# Altium project develboard-sdk.PrjPcb (part 1 of 2)
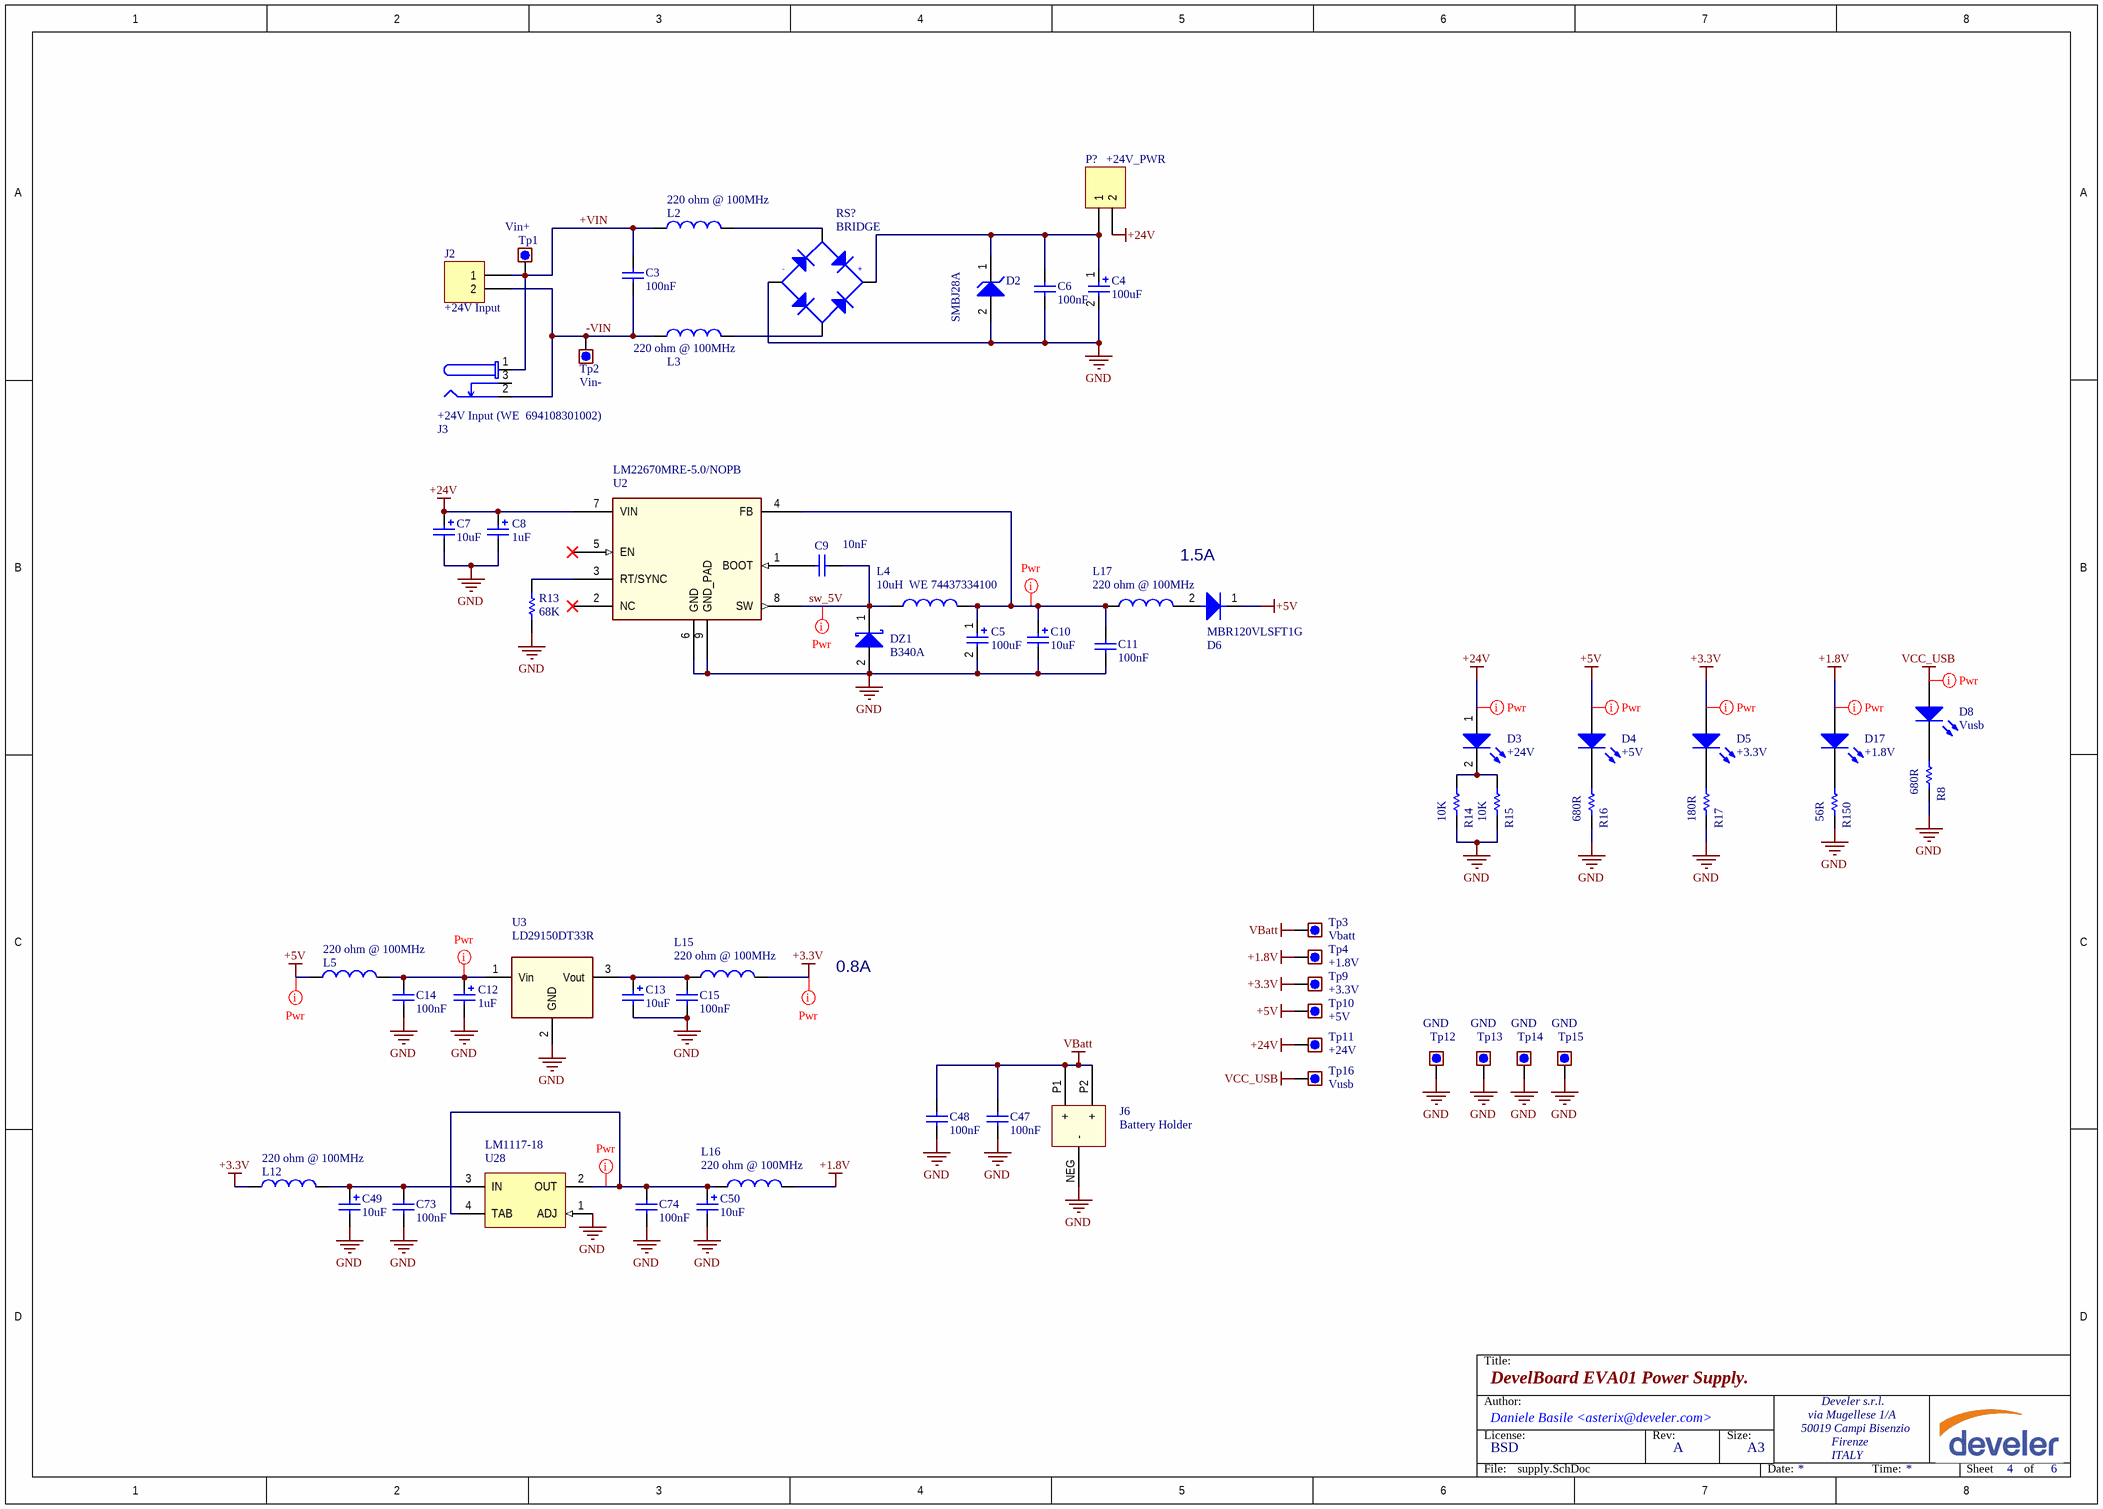
[diagram p0: supply.SchDoc]
6 sheets, 204 parts. Net scope: flat (ports and power ports of the same name join across sheets).
Board file: develboard_sdk.PcbDoc
Sheets:
  supply.SchDoc
  wifi.schdoc
  develboard.SchDoc
  usb_ethernet.SchDoc
  sd_debug.SchDoc
  connectors.SchDoc

## Sheet supply.SchDoc: DevelBoard EVA01 Power Supply.
size A3; Author: Daniele Basile <asterix@develer.com>; Organization: Develer s.r.l.; Address1: via Mugellese 1/A; Address2: 50019 Campi Bisenzio; Address3: Firenze; Address4: ITALY; DocumentNumber: 2; Revision: A; SheetNumber: 4; SheetTotal: 6

### Parts
(Parts that share a designator on the sheet are numbered #1, #2 ... from top to bottom, then left to right.)
C3  100nF  [0603_[1608]]
C4  100uF  [CAP_6x6_D8_SMD]
C5  100uF  [[7343]_CAP_TAN]
C6  100nF  [0603_[1608]]
C7  10uF  [1206_[3216]]
C8  1uF  [1206_[3216]]
C9  10nF  [0603_[1608]]
C10  10uF  [1206_[3216]]
C11  100nF  [0603_[1608]]
C12  1uF  [1206_[3216]]
C13  10uF  [1206_[3216]]
C14  100nF  [0603_[1608]]
C15  100nF  [0603_[1608]]
C47  100nF  [0603_[1608]]
C48  100nF  [0603_[1608]]
C49  10uF  [1206_[3216]]
C50  10uF  [1206_[3216]]
C73  100nF  [0603_[1608]]
C74  100nF  [0603_[1608]]
D2  SMBJ28A  [DO214AA_12]
D3  +24V  [0603_[1608]_LED]
D4  +5V  [0603_[1608]_LED]
D5  +3.3V  [0603_[1608]_LED]
D6  MBR120VLSFT1G  [SOD-123]
D8  Vusb  [0603_[1608]_LED]
D17  +1.8V  [0603_[1608]_LED]
DZ1  B340A  [DO214AA_12]
J2  +24V Input  [TBLOCK_1X2_3.5MM_HOR_THD]
J3  +24V Input (WE  694108301002)  [DC_Jack_6.5x2.5mm_right_tht]
J6  Battery Holder  [Battery_holder_20mm_thd]
L2  220 ohm @ 100MHz  [0805_[2012]]
L3  220 ohm @ 100MHz  [0805_[2012]]
L4  10uH  WE 74437334100  [WE-LHMI_5020]
L5  220 ohm @ 100MHz  [0805_[2012]]
L12  220 ohm @ 100MHz  [0805_[2012]]
L15  220 ohm @ 100MHz  [0805_[2012]]
L16  220 ohm @ 100MHz  [0805_[2012]]
L17  220 ohm @ 100MHz  [0805_[2012]]
P?#1  +24V_PWR  [HDR1X2]
R8  680R  [0603_[1608]]
R13  68K  [0603_[1608]]
R14  10K  [0603_[1608]]
R15  10K  [0603_[1608]]
R16  680R  [0603_[1608]]
R17  180R  [0603_[1608]]
R150  56R  [0603_[1608]]
RS?  BRIDGE
Tp1  Vin+  [TEST_POINT_THD_D1.6MM]  (no BOM)
Tp2  Vin-  [TEST_POINT_THD_D1.6MM]  (no BOM)
Tp3  Vbatt  [TEST_POINT_THD_D1.6MM]  (no BOM)
Tp4  +1.8V  [TEST_POINT_THD_D1.6MM]  (no BOM)
Tp9  +3.3V  [TEST_POINT_THD_D1.6MM]  (no BOM)
Tp10  +5V  [TEST_POINT_THD_D1.6MM]  (no BOM)
Tp11  +24V  [TEST_POINT_THD_D1.6MM]  (no BOM)
Tp12  GND  [TEST_POINT_THD_D1.6MM]  (no BOM)
Tp13  GND  [TEST_POINT_THD_D1.6MM]  (no BOM)
Tp14  GND  [TEST_POINT_THD_D1.6MM]  (no BOM)
Tp15  GND  [TEST_POINT_THD_D1.6MM]  (no BOM)
Tp16  Vusb  [TEST_POINT_THD_D1.6MM]  (no BOM)
U2  LM22670MRE-5.0/NOPB  [SOIC8_PAD]
U3  LD29150DT33R  [TO-252_D2PAK_LARGEPAD]
U28  LM1117-18  [SOT-223]

### Nets
+1.8V: D17.1(A) L16.1 Tp4.1
+3.3V: D5.1(A) L12.1 L15.1 Tp9.1
+5V: D4.1(A) D6.1(K) L5.1 Tp10.1
+24V: C7.1 C8.1 D3.1(A) P?#1.2 Tp11.1 U2.7(VIN)
GND: C4.2 C5.2 C6.1 C7.2 C8.2 C10.2 C11.1 C12.2 C13.2 C14.1 C15.1 C47.1 C48.1 C49.2 C50.2 C73.1 C74.1 D2.2(A) DZ1.2(A) J6.NEG(-) R8.1 R13.1 R14.1 R15.1 R16.1 R17.1 R150.1 RS?.2 Tp12.1 Tp13.1 Tp14.1 Tp15.1 U2.6(GND) U2.9(GND_PAD) U3.2(GND) U28.1(ADJ)
VBatt: C47.2 C48.2 J6.P1(+) J6.P2(+) Tp3.1
VCC_USB: D8.1(A) Tp16.1
+VIN: C3.2 J2.1 J3.1 L2.1 Tp1.1
-VIN: C3.1 J2.2 J3.2 L3.1 Tp2.1
sw_5V: C9.2 DZ1.1(K) L4.1 U2.8(SW)
NetC4_1: C4.1 C6.2 D2.1(K) P?#1.1 RS?.4
NetC5_1: C5.1 C10.1 C11.2 L4.2 L17.2 U2.4(FB)
NetC9_1: C9.1 U2.1(BOOT)
NetC12_1: C12.1 C14.2 L5.2 U3.1(Vin)
NetC13_1: C13.1 C15.2 L15.2 U3.3(Vout)
NetC49_1: C49.1 C73.2 L12.2 U28.3(IN)
NetC50_1: C50.1 C74.2 L16.2 U28.2(OUT) U28.4(TAB)
NetD3_2: D3.2(K) R14.2 R15.2
NetD4_2: D4.2(K) R16.2
NetD5_2: D5.2(K) R17.2
NetD6_2: D6.2(A) L17.1
NetD8_2: D8.2(K) R8.2
NetD17_2: D17.2(K) R150.2
NetL2_2: L2.2 RS?.1
NetL3_2: L3.2 RS?.3
NetR13_2: R13.2 U2.3(RT/SYNC)

Not connected (* = marked no-connect by the designer): J3 3; U2 2(NC)* 5(EN)*

### Layout directives
net class Power: +1.8V, +3.3V, +5V, +24V, NetC5_1, NetC12_1, NetC50_1, sw_5V, VCC_USB

### Notes on the sheet
- 1.5A
- 0.8A
- Title:
- Author:
- License:
- BSD
- Rev:
- Size:
- A3
- File:
- Date:
- Time:
- Sheet
- of
- (in symbol PONTE) -; +

### Library data of the parts
C3 C6 C9 C11 C14 C15 C47 C48 C73 C74 = Cap: Ceramic X7R 50V; Value: 100pF; Published: 8-Jun-2000; LatestRevisionDate: 17-Jul-2002; LatestRevisionNote: Re-released for DXP Platform.; PackageReference: RAD-0.3; Publisher: Altium Limited; PackageDescription: Radial Cap, Thru-Hole; 2 Leads; 0.3 in Pin Spacing
C4 = Cap Pol1: EEEFK1H101P SMT 6x6 35V; Value: 10uF; Published: 8-Jun-2000; Revision: July-2002: Re-released for DXP Platform.; Publisher: Altium Limited
C5 = Cap Pol1: Tantalum 10V (T495D107K010ATE100); Value: 10uF; Published: 8-Jun-2000; Revision: July-2002: Re-released for DXP Platform.; Publisher: Altium Limited
C7 C10 C13 C49 C50 = Cap Pol1: Ceramic X7R 50V; Published: 8-Jun-2000; Revision: July-2002: Re-released for DXP Platform.; Publisher: Altium Limited; Value: 10uF
C8 C12 = Cap Pol1: Ceramic X7R 50V; Value: 10uF; Published: 8-Jun-2000; Revision: July-2002: Re-released for DXP Platform.; Publisher: Altium Limited
D2 = D Zener: TRANSIL (SM6T12A); Published: 8-Jun-2000; LatestRevisionDate: 17-Jul-2002; LatestRevisionNote: Re-released for DXP Platform.; PackageReference: DIODE-0.7; Publisher: Altium Limited; PackageDescription: Diode, Thru-Hole; 2 Leads; 0.7 in Pin Spacing
D3-D5 D8 D17 = LED0: LED Green; Published: 8-Jun-2000; LatestRevisionDate: 08-Jul-2005; LatestRevisionNote: Mech Layer 1 removed.; PackageReference: LED-0; Publisher: Altium Limited; PackageDescription: LED; 2 Leads
D6 = Diode: Diode Schottky  low Vf, If 1A (PMEG3010ER; MBRX120LF)
DZ1 = D Schottky: Diode Schottky (STPS2L40U); Published: 8-Jun-2000; LatestRevisionDate: 17-Jul-2002; LatestRevisionNote: Re-released for DXP Platform.; PackageReference: SMB; Publisher: Altium Limited; PackageDescription: DO-214-AA/SMB; 2 C-Bend Leads; Body 5.3 x 3.6 mm, inc. leads (LxW); Code_JEDEC: DO-214-AA
J2 = Header 2: Terminal block Header 3.5mm Horizontal (WE 691322110002); LatestRevisionDate: 17-Jul-2002; LatestRevisionNote: Re-released for DXP Platform.; Publisher: Altium Limited
J3 = WE-DC Power Jack 694108301002: WR-DC_DC Power Jack_Right Angled_THT; Manufacturer: W¨¹rth Elektronik eiSos GmbH; ComponentLink1 Description: Manufacturer; ComponentLink2 Description: Datasheet; NoPins: 3; ComponentLink1URL: http://www.we-online.de; ComponentLink2URL: http://katalog.we-online.de/em/datasheet/6941xx301002.pdf; Created by: Karrer Zheng; Created Date: 10/17/2014; partNo: 694108301002
J6 = Battery_holder_3002: WE 79523211; KEYSTONE 3009
L2 L3 L5 L12 = Inductor: WE 742792022; Code_IEC: 1005; Value: 10mH; Published: 8-Jun-2000; LatestRevisionDate: 29-May-2009; LatestRevisionNote: IPC-7351 Footprint Added.; PackageReference: 0402-A; Publisher: Altium Limited; PackageDescription: Chip Inductor; Code_JEITA: 0402
L4 = Inductor: SMD Shielded Tiny Power Inductor; Code_IEC: 1005; Value: 10mH; Published: 8-Jun-2000; LatestRevisionDate: 29-May-2009; LatestRevisionNote: IPC-7351 Footprint Added.; PackageReference: 0402-A; Publisher: Altium Limited; PackageDescription: Chip Inductor; Code_JEITA: 0402
L15-L17 = Inductor: WE 742792022
P?#1 = Header 2: Header, 2-Pin; LatestRevisionDate: 17-Jul-2002; LatestRevisionNote: Re-released for DXP Platform.; Publisher: Altium Limited
R8 R13-R17 R150 = Res1: Resistor; Revision: July-2002: Re-released for DXP Platform.
RS? = PONTE
Tp1-Tp4 Tp9-Tp16 = Test_point
U2 = LM22670MR-ADJ
U3 = LD29150DT33R: Very Low Drop Linear regulator 3.3V (BA33BC0FP-E2; MIC2940A-3.3WU)
U28 = LM317AEMP: LDO, ADJ (ZLDO1117;LM1117IMP-ADJ/NOPB;LD1117S); Manufacturer: National Semiconductor; PackageTopMarking: XYTT*N07A; PowerWise: N; CompType: LDO IC; Published: 4-Dec-2008; DatasheetVersion: Apr-2007; PackageVersion: revB, Apr-2003; PackageReference: MP04A; Publisher: Altium Limited; PackageDescription: Molded SOT-223, 6.50 x 3.56 x 1.6mm Body, 4 Lead, 2.3mm Pitch; Supplier 1: Farnell; Supplier Part Number 1: 9779272RL; Supplier 2: Farnell; Supplier Part Number 2: 9779272; PartNumber: LM317AEMP; RoHS: N; PinCount: 4; Code_JEDEC: TO-261-AA; Code_IPC: SOT223-4; ComponentLink1Description: LM317 Datasheet; ComponentLink1URL: http://www.national.com/ds/LM/LM317.pdf; ComponentLink2Description: LM317 Web Page; ComponentLink2URL: http://www.national.com/pf/LM/LM317.html; ComponentLink3Description: MP04A Package Page; ComponentLink3URL: http://www.national.com/packaging/folders/mp04a.html

## Sheet wifi.schdoc: DevelBoard EVA WiFi Module.
size A3; Author: Daniele Basile <asterix@develer.com>; Organization: Develer s.r.l.; Address1: via Mugellese 1/A; Address2: 50019 Campi Bisenzio; Address3: Firenze; Address4: ITALY; DocumentNumber: 6; Revision: EVA 0; SheetNumber: 6; SheetTotal: 6
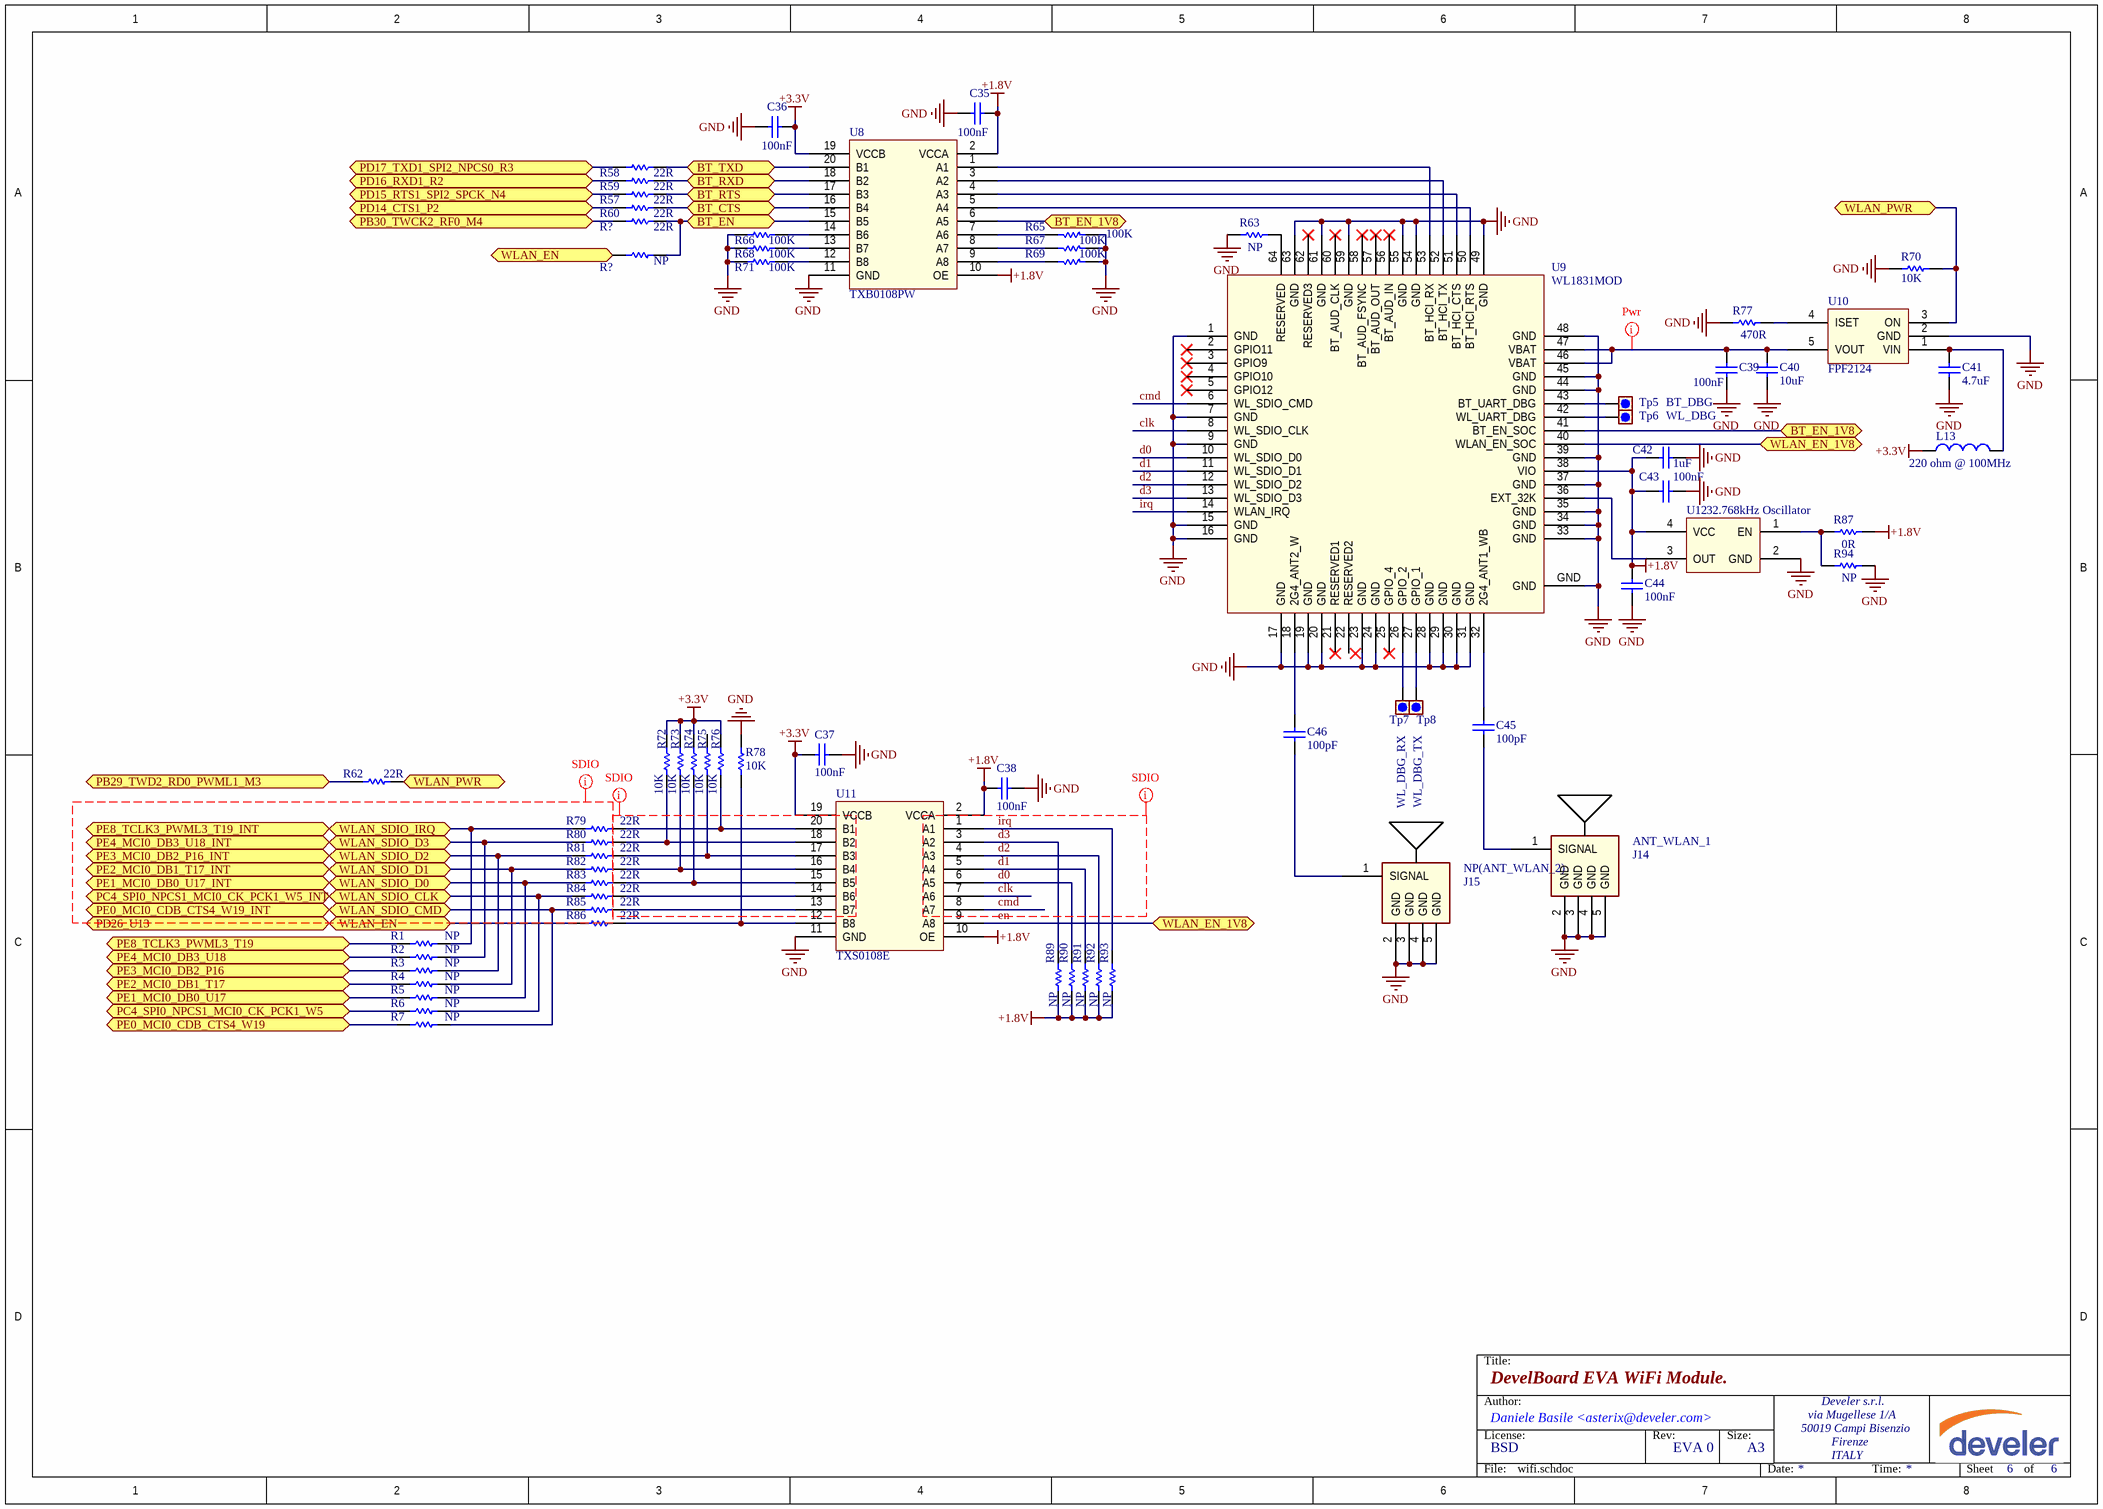
[diagram p1: wifi.schdoc]

### Parts
(Parts that share a designator on the sheet are numbered #1, #2 ... from top to bottom, then left to right.)
C35  100nF  [0603_[1608]]
C36  100nF  [0603_[1608]]
C37  100nF  [0603_[1608]]
C38  100nF  [0603_[1608]]
C39  100nF  [0603_[1608]]
C40  10uF  [1206_[3216]]
C41  4.7uF  [0805_[2012]]
C42  1uF  [1206_[3216]]
C43  100nF  [0603_[1608]]
C44  100nF  [0603_[1608]]
C45  100pF  [0603_[1608]]
C46  100pF  [0603_[1608]]
J14  ANT_WLAN_1  [SMA_Jack_Female_5.08mm_THD]
J15  NP(ANT_WLAN_2)  [SMA_Jack_Female_5.08mm_THD]
L13  220 ohm @ 100MHz  [0805_[2012]]
R1  NP  [0603_[1608]]
R2  NP  [0603_[1608]]
R3  NP  [0603_[1608]]
R4  NP  [0603_[1608]]
R5  NP  [0603_[1608]]
R6  NP  [0603_[1608]]
R7  NP  [0603_[1608]]
R57  22R  [0603_[1608]]
R58  22R  [0603_[1608]]
R59  22R  [0603_[1608]]
R60  22R  [0603_[1608]]
R62  22R  [0603_[1608]]
R63  NP  [0603_[1608]]
R65  100K  [0603_[1608]]
R66  100K  [0603_[1608]]
R67  100K  [0603_[1608]]
R68  100K  [0603_[1608]]
R69  100K  [0603_[1608]]
R70  10K  [0603_[1608]]
R71  100K  [0603_[1608]]
R72  10K  [0603_[1608]]
R73  10K  [0603_[1608]]
R74  10K  [0603_[1608]]
R75  10K  [0603_[1608]]
R76  10K  [0603_[1608]]
R77  470R  [0603_[1608]]
R78  10K  [0603_[1608]]
R79  22R  [0603_[1608]]
R80  22R  [0603_[1608]]
R81  22R  [0603_[1608]]
R82  22R  [0603_[1608]]
R83  22R  [0603_[1608]]
R84  22R  [0603_[1608]]
R85  22R  [0603_[1608]]
R86  22R  [0603_[1608]]
R87  0R  [0603_[1608]]
R89  NP  [0603_[1608]]
R90  NP  [0603_[1608]]
R91  NP  [0603_[1608]]
R92  NP  [0603_[1608]]
R93  NP  [0603_[1608]]
R94  NP  [0603_[1608]]
R?#1  22R  [0603_[1608]]
R?#2  NP  [0603_[1608]]
Tp5  BT_DBG  [TEST_POINT_SMD_D1MM]  (no BOM)
Tp6  WL_DBG  [TEST_POINT_SMD_D1MM]  (no BOM)
Tp7  WL_DBG_RX  [TEST_POINT_SMD_D1MM]  (no BOM)
Tp8  WL_DBG_TX  [TEST_POINT_SMD_D1MM]  (no BOM)
U8  TXB0108PW  [TSOP65P640X120-20L]
U9  WL1831MOD  [WL18XX_E-13.4X13.3-N100_0.75]
U10  FPF2124  [SOT-23-5]
U11  TXS0108E  [TSOP65P640X120-20L]
U12  32.768kHz Oscillator  [CRYSTAL_3.2X1.5MM_4P_SMD]

### Ports
BT_CTS, BT_EN, BT_EN_1V8, BT_RTS, BT_RXD, BT_TXD, PB29_TWD2_RD0_PWML1_M3, PB30_TWCK2_RF0_M4, PC4_SPI0_NPCS1_MCI0_CK_PCK1_W5, PC4_SPI0_NPCS1_MCI0_CK_PCK1_W5_INT, PD14_CTS1_P2, PD15_RTS1_SPI2_SPCK_N4, PD16_RXD1_R2, PD17_TXD1_SPI2_NPCS0_R3, PD26_U13, PE0_MCI0_CDB_CTS4_W19, PE0_MCI0_CDB_CTS4_W19_INT, PE1_MCI0_DB0_U17, PE1_MCI0_DB0_U17_INT, PE2_MCI0_DB1_T17, PE2_MCI0_DB1_T17_INT, PE3_MCI0_DB2_P16, PE3_MCI0_DB2_P16_INT, PE4_MCI0_DB3_U18, PE4_MCI0_DB3_U18_INT, PE8_TCLK3_PWML3_T19, PE8_TCLK3_PWML3_T19_INT, WLAN_EN, WLAN_EN_1V8, WLAN_PWR, WLAN_SDIO_CLK, WLAN_SDIO_CMD, WLAN_SDIO_D0, WLAN_SDIO_D1, WLAN_SDIO_D2, WLAN_SDIO_D3, WLAN_SDIO_IRQ

### Nets
+1.8V: C35.2 C38.2 C42.2 C43.2 C44.2 R87.1 R89.1 R90.1 R91.1 R92.1 R93.1 U8.2(VCCA) U8.10(OE) U9.38(VIO) U11.2(VCCA) U11.10(OE) U12.4(VCC)
+3.3V: C36.2 C37.2 L13.2 R72.1 R73.1 R74.1 R76.1 U8.19(VCCB) U11.19(VCCB)
GND: C35.1 C36.1 C37.1 C38.1 C39.1 C40.1 C41.1 C42.1 C43.1 C44.1 J14.2(GND) J14.3(GND) J14.4(GND) J14.5(GND) J15.2(GND) J15.3(GND) J15.4(GND) J15.5(GND) R63.2 R65.2 R66.2 R67.2 R68.2 R69.2 R70.1 R71.2 R77.2 R78.1 R94.1 U8.11(GND) U9.1(GND) U9.7(GND) U9.9(GND) U9.15(GND) U9.16(GND) U9.17(GND) U9.19(GND) U9.20(GND) U9.23(GND) U9.24(GND) U9.28(GND) U9.29(GND) U9.30(GND) U9.31(GND) U9.33(GND) U9.34(GND) U9.35(GND) U9.37(GND) U9.39(GND) U9.44(GND) U9.45(GND) U9.48(GND) U9.49(GND) U9.54(GND) U9.55(GND) U9.59(GND) U9.61(GND) U9.63(GND) U9.GND U10.2(GND) U11.11(GND) U12.2(GND)
BT_CTS: R60.2 U8.16(B4) ; port BT_CTS
BT_EN: R?#1.2 R?#2.2 U8.15(B5) ; port BT_EN
BT_EN_1V8: U8.6(A5) U9.41(BT_EN_SOC) ; port BT_EN_1V8
BT_RTS: R57.2 U8.17(B3) ; port BT_RTS
BT_RXD: R59.2 U8.18(B2) ; port BT_RXD
BT_TXD: R58.2 U8.20(B1) ; port BT_TXD
clk: U9.8(WL_SDIO_CLK) U11.7(A6)
cmd: U9.6(WL_SDIO_CMD) U11.8(A7)
d0: R90.2 U9.10(WL_SDIO_D0) U11.6(A5)
d1: R91.2 U9.11(WL_SDIO_D1) U11.5(A4)
d2: R92.2 U9.12(WL_SDIO_D2) U11.4(A3)
d3: R89.2 U9.13(WL_SDIO_D3) U11.3(A2)
en: U9.40(WLAN_EN_SOC) U11.9(A8) ; port WLAN_EN_1V8
irq: R93.2 U9.14(WLAN_IRQ) U11.1(A1)
PB29_TWD2_RD0_PWML1_M3: R62.1 ; port PB29_TWD2_RD0_PWML1_M3
PB30_TWCK2_RF0_M4: R?#1.1 ; port PB30_TWCK2_RF0_M4
PC4_SPI0_NPCS1_MCI0_CK_PCK1_W5: R6.2 ; port PC4_SPI0_NPCS1_MCI0_CK_PCK1_W5
PC4_SPI0_NPCS1_MCI0_CK_PCK1_W5_INT: R6.1 R84.2 ; port WLAN_SDIO_CLK, port PC4_SPI0_NPCS1_MCI0_CK_PCK1_W5_INT
PD14_CTS1_P2: R60.1 ; port PD14_CTS1_P2
PD15_RTS1_SPI2_SPCK_N4: R57.1 ; port PD15_RTS1_SPI2_SPCK_N4
PD16_RXD1_R2: R59.1 ; port PD16_RXD1_R2
PD17_TXD1_SPI2_NPCS0_R3: R58.1 ; port PD17_TXD1_SPI2_NPCS0_R3
PD26_U13: R86.2 R?#2.1 ; port WLAN_EN, port PD26_U13
PE0_MCI0_CDB_CTS4_W19: R7.2 ; port PE0_MCI0_CDB_CTS4_W19
PE0_MCI0_CDB_CTS4_W19_INT: R7.1 R85.2 ; port WLAN_SDIO_CMD, port PE0_MCI0_CDB_CTS4_W19_INT
PE1_MCI0_DB0_U17: R5.2 ; port PE1_MCI0_DB0_U17
PE1_MCI0_DB0_U17_INT: R5.1 R83.2 ; port WLAN_SDIO_D0, port PE1_MCI0_DB0_U17_INT
PE2_MCI0_DB1_T17: R4.2 ; port PE2_MCI0_DB1_T17
PE2_MCI0_DB1_T17_INT: R4.1 R82.2 ; port WLAN_SDIO_D1, port PE2_MCI0_DB1_T17_INT
PE3_MCI0_DB2_P16: R3.2 ; port PE3_MCI0_DB2_P16
PE3_MCI0_DB2_P16_INT: R3.1 R81.2 ; port WLAN_SDIO_D2, port PE3_MCI0_DB2_P16_INT
PE4_MCI0_DB3_U18: R2.2 ; port PE4_MCI0_DB3_U18
PE4_MCI0_DB3_U18_INT: R2.1 R80.2 ; port WLAN_SDIO_D3, port PE4_MCI0_DB3_U18_INT
PE8_TCLK3_PWML3_T19: R1.2 ; port PE8_TCLK3_PWML3_T19
PE8_TCLK3_PWML3_T19_INT: R1.1 R79.2 ; port WLAN_SDIO_IRQ, port PE8_TCLK3_PWML3_T19_INT
WLAN_PWR: R62.2 R70.2 U10.3(ON) ; port WLAN_PWR
NetC39_2: C39.2 C40.2 U9.46(VBAT) U9.47(VBAT) U10.5(VOUT)
NetC41_2: C41.2 L13.1 U10.1(VIN)
NetC45_1: C45.1 U9.32(2G4_ANT1_WB)
NetC45_2: C45.2 J14.1(SIGNAL)
NetC46_1: C46.1 U9.18(2G4_ANT2_W)
NetC46_2: C46.2 J15.1(SIGNAL)
NetR63_1: R63.1 U9.64(RESERVED)
NetR65_1: R65.1 U8.7(A6)
NetR66_1: R66.1 U8.14(B6)
NetR67_1: R67.1 U8.8(A7)
NetR68_1: R68.1 U8.13(B7)
NetR69_1: R69.1 U8.9(A8)
NetR71_1: R71.1 U8.12(B8)
NetR72_2: R72.2 R80.1 U11.18(B2)
NetR73_2: R73.2 R82.1 U11.16(B4)
NetR74_2: R74.2 R83.1 U11.15(B5)
NetR75_2: R75.2 R81.1 U11.17(B3)
NetR76_2: R76.2 R79.1 U11.20(B1)
NetR77_1: R77.1 U10.4(ISET)
NetR78_2: R78.2 R86.1 U11.12(B8)
NetR84_1: R84.1 U11.14(B6)
NetR85_1: R85.1 U11.13(B7)
NetR87_2: R87.2 R94.2 U12.1(EN)
NetTp5_1: Tp5.1 U9.43(BT_UART_DBG)
NetTp6_1: Tp6.1 U9.42(WL_UART_DBG)
NetTp7_1: Tp7.1 U9.26(GPIO_2)
NetTp8_1: Tp8.1 U9.27(GPIO_1)
NetU8_1: U8.1(A1) U9.53(BT_HCI_RX)
NetU8_3: U8.3(A2) U9.52(BT_HCI_TX)
NetU8_4: U8.4(A3) U9.51(BT_HCI_CTS)
NetU8_5: U8.5(A4) U9.50(BT_HCI_RTS)
NetU9_36: U9.36(EXT_32K) U12.3(OUT)

Not connected (* = marked no-connect by the designer): R75 1; U9 2(GPIO11)* 3(GPIO9)* 4(GPIO10)* 5(GPIO12)* 21(RESERVED1)* 22(RESERVED2) 25(GPIO_4)* 56(BT_AUD_IN)* 57(BT_AUD_OUT)* 58(BT_AUD_FSYNC)* 60(BT_AUD_CLK)* 62(RESERVED3)*

### Layout directives
net class Power: NetC39_2
net class SDIO_BUS: (no net found under the mark)
net class SDIO: (no net found under the mark)
net class SDIO_LOWBUS: clk, cmd, d0, d1, d2, d3, irq

### Notes on the sheet
- Title:
- Author:
- License:
- BSD
- Rev:
- Size:
- A3
- File:
- Date:
- Time:
- Sheet
- of

### Library data of the parts
C35-C39 C42-C44 = Cap: Ceramic X7R 50V; Value: 10nF; Published: 8-Jun-2000; Revision: July-2002: Re-released for DXP Platform.; Publisher: Altium Limited
C40 = Cap: Ceramic X5R 25V; Value: 10nF; Published: 8-Jun-2000; Revision: July-2002: Re-released for DXP Platform.; Publisher: Altium Limited
C41 = Cap: Ceramic X7R 10V; Value: 10nF; Published: 8-Jun-2000; Revision: July-2002: Re-released for DXP Platform.; Publisher: Altium Limited
C45 C46 = Cap: Ceramic COG 50V; Value: 10nF; Published: 8-Jun-2000; Revision: July-2002: Re-released for DXP Platform.; Publisher: Altium Limited
J14 J15 = ANTENNA: TE 5-1814400-1
L13 = Inductor: WE 742792022
R1-R7 R57-R60 R62 R63 R65-R87 R89-R94 R?#1 R?#2 = Res1: Resistor; Value: 1K; Published: 8-Jun-2000; Revision: July-2002: Re-released for DXP Platform.; Publisher: Altium Limited
Tp5-Tp8 = Test_point: Test point
U8 U11 = TXB0108PW: 8-bit bidirectional level translator
U12 = Si501/2/3_32768Hz: 32.768kHz Oscillator (EPSON  X1B0002110001 SG-3030CM)

## Sheet develboard.SchDoc: DevelBoard EVA01 module pinout
size A3; Author: Daniele Basile <asterix@develer.com>; Organization: Develer s.r.l.; Address1: via Mugellese 1/A; Address2: 50019 Campi Bisenzio; Address3: Firenze; Address4: ITALY; DocumentNumber: 3; Revision: A; SheetNumber: 2; SheetTotal: 6
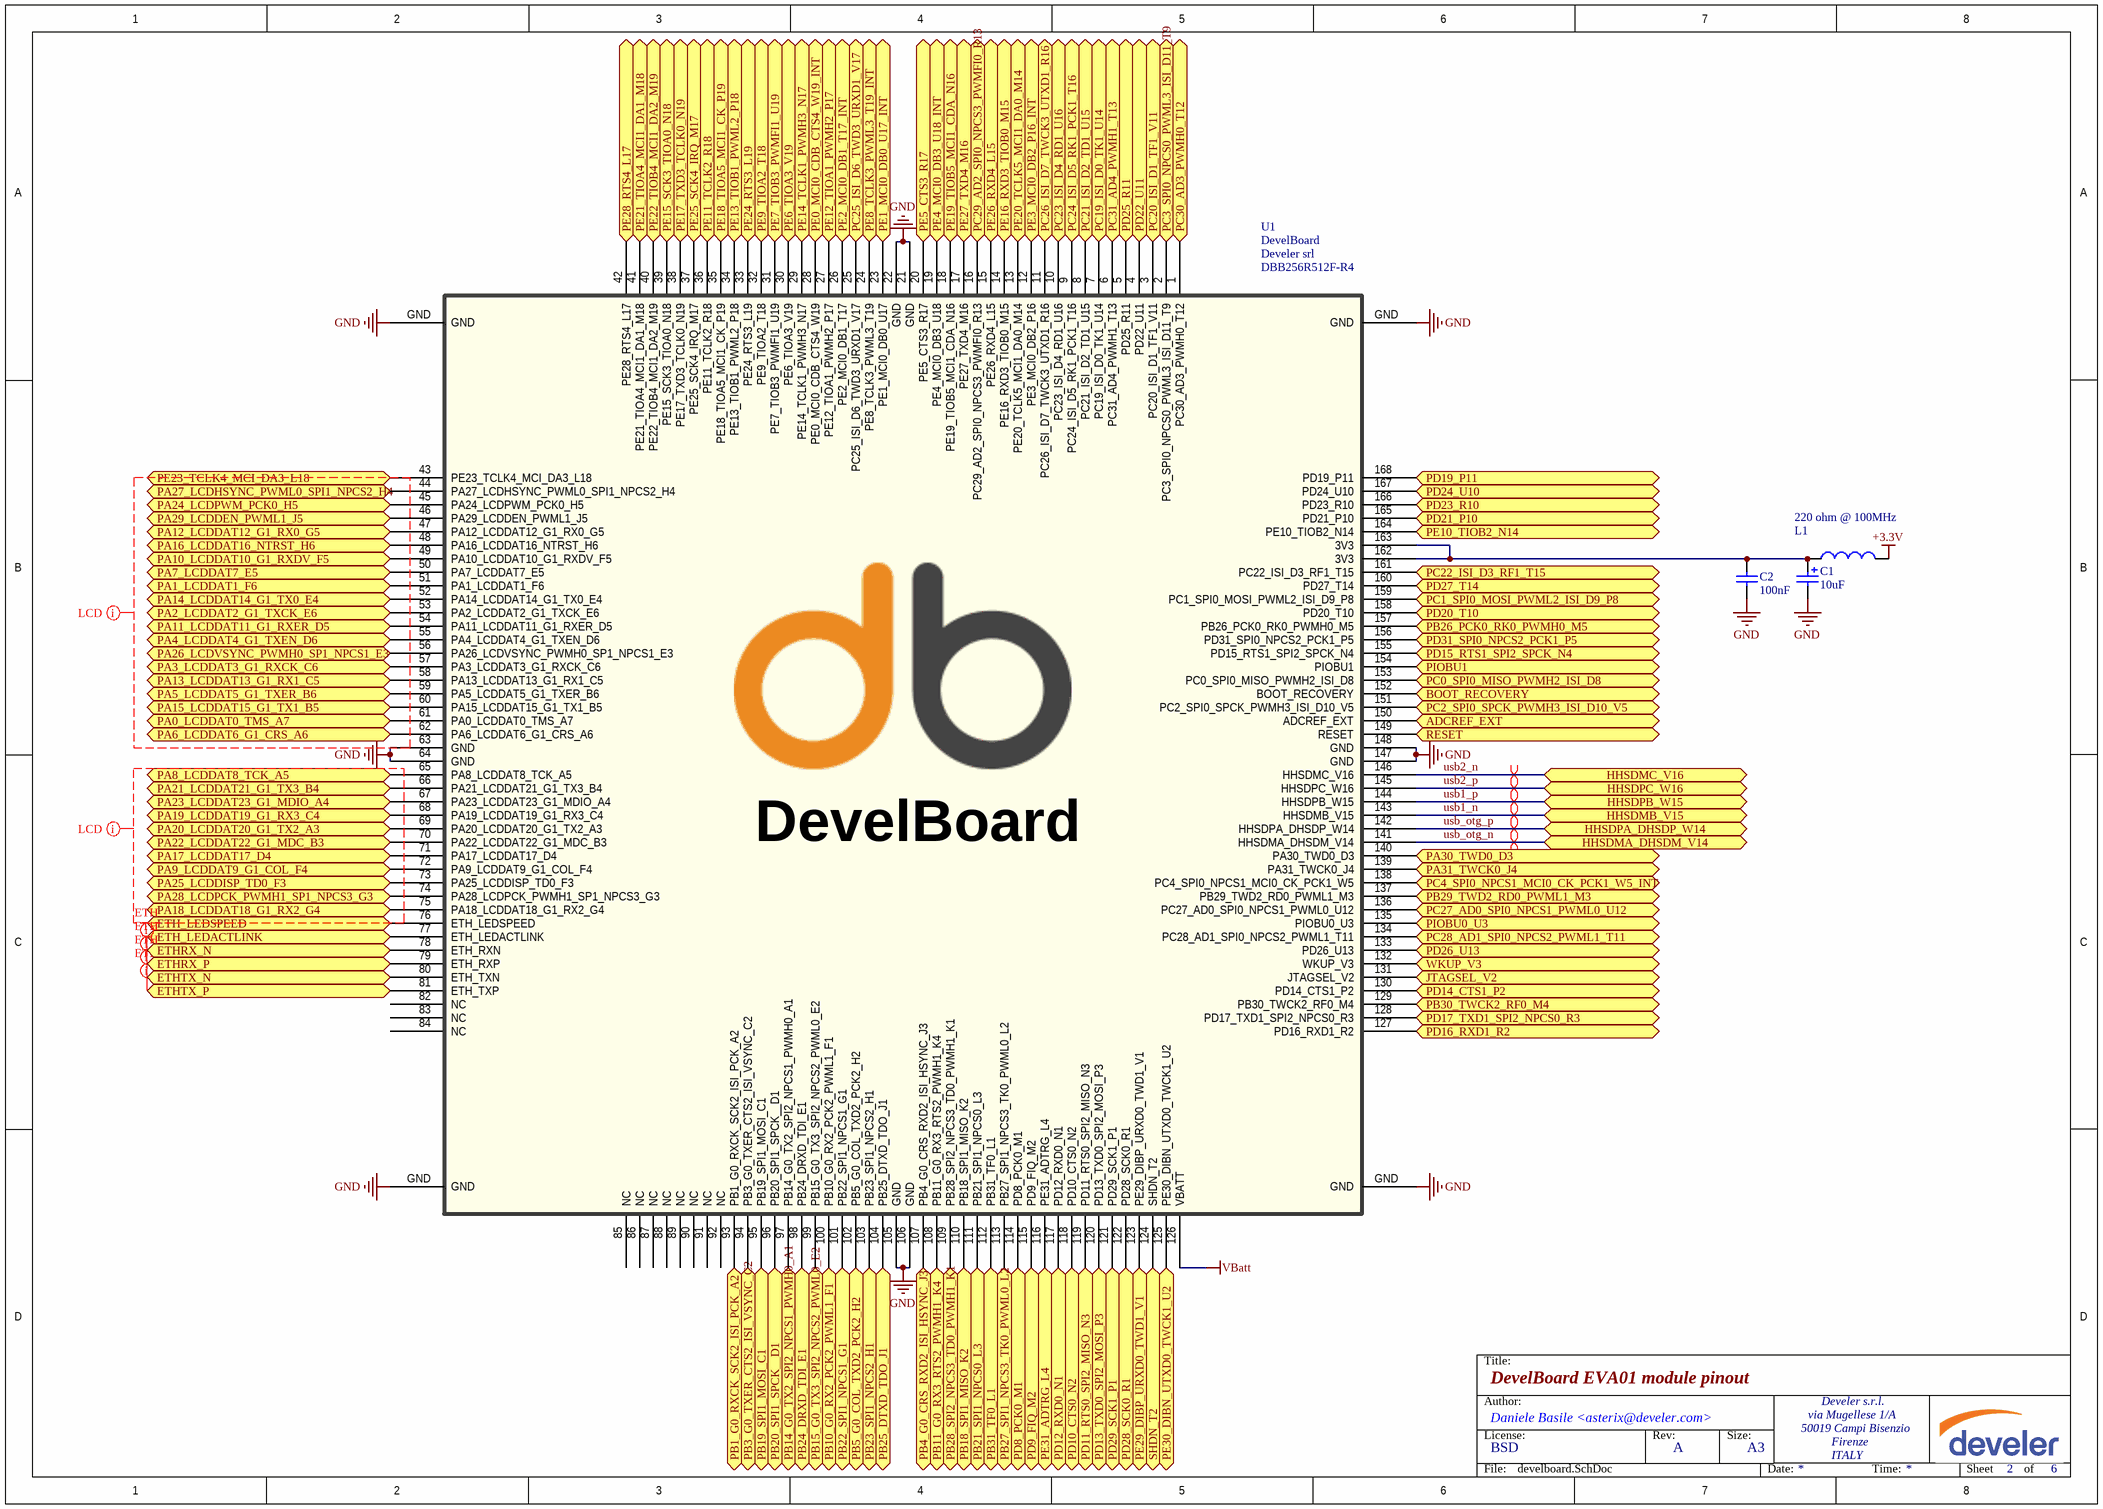
[diagram p2: develboard.SchDoc]

### Parts
C1  10uF  [1206_[3216]]
C2  100nF  [0603_[1608]]
L1  220 ohm @ 100MHz  [0805_[2012]]
U1  DevelBoard  Company: Develer srl  Order Code: DBB256R512F-R4  [develboard_footprint]

### Ports
ADCREF_EXT, BOOT_RECOVERY, ETH_LEDACTLINK, ETH_LEDSPEED, ETHRX_N, ETHRX_P, ETHTX_N, ETHTX_P, HHSDMA_DHSDM_V14, HHSDMB_V15, HHSDMC_V16, HHSDPA_DHSDP_W14, HHSDPB_W15, HHSDPC_W16, JTAGSEL_V2, PA0_LCDDAT0_TMS_A7, PA1_LCDDAT1_F6, PA2_LCDDAT2_G1_TXCK_E6, PA3_LCDDAT3_G1_RXCK_C6, PA4_LCDDAT4_G1_TXEN_D6, PA5_LCDDAT5_G1_TXER_B6, PA6_LCDDAT6_G1_CRS_A6, PA7_LCDDAT7_E5, PA8_LCDDAT8_TCK_A5, PA9_LCDDAT9_G1_COL_F4, PA10_LCDDAT10_G1_RXDV_F5, PA11_LCDDAT11_G1_RXER_D5, PA12_LCDDAT12_G1_RX0_G5, PA13_LCDDAT13_G1_RX1_C5, PA14_LCDDAT14_G1_TX0_E4, PA15_LCDDAT15_G1_TX1_B5, PA16_LCDDAT16_NTRST_H6, PA17_LCDDAT17_D4, PA18_LCDDAT18_G1_RX2_G4, PA19_LCDDAT19_G1_RX3_C4, PA20_LCDDAT20_G1_TX2_A3, PA21_LCDDAT21_G1_TX3_B4, PA22_LCDDAT22_G1_MDC_B3, PA23_LCDDAT23_G1_MDIO_A4, PA24_LCDPWM_PCK0_H5, PA25_LCDDISP_TD0_F3, PA26_LCDVSYNC_PWMH0_SP1_NPCS1_E3, PA27_LCDHSYNC_PWML0_SPI1_NPCS2_H4, PA28_LCDPCK_PWMH1_SP1_NPCS3_G3, PA29_LCDDEN_PWML1_J5, PA30_TWD0_D3, PA31_TWCK0_J4, PB1_G0_RXCK_SCK2_ISI_PCK_A2, PB3_G0_TXER_CTS2_ISI_VSYNC_C2, PB4_G0_CRS_RXD2_ISI_HSYNC_J3, PB5_G0_COL_TXD2_PCK2_H2, PB10_G0_RX2_PCK2_PWML1_F1, PB11_G0_RX3_RTS2_PWMH1_K4, PB14_G0_TX2_SPI2_NPCS1_PWMH0_A1, PB15_G0_TX3_SPI2_NPCS2_PWML0_E2, PB18_SPI1_MISO_K2, PB19_SPI1_MOSI_C1, PB20_SPI1_SPCK__D1, PB21_SPI1_NPCS0_L3, PB22_SPI1_NPCS1_G1, PB23_SPI1_NPCS2_H1, PB24_DRXD_TDI_E1, PB25_DTXD_TDO_J1, PB26_PCK0_RK0_PWMH0_M5, PB27_SPI1_NPCS3_TK0_PWML0_L2, PB28_SPI2_NPCS3_TD0_PWMH1_K1, PB29_TWD2_RD0_PWML1_M3, PB30_TWCK2_RF0_M4, PB31_TF0_L1, PC0_SPI0_MISO_PWMH2_ISI_D8, PC1_SPI0_MOSI_PWML2_ISI_D9_P8, PC2_SPI0_SPCK_PWMH3_ISI_D10_V5, PC3_SPI0_NPCS0_PWML3_ISI_D11_T9, PC4_SPI0_NPCS1_MCI0_CK_PCK1_W5_INT, PC19_ISI_D0_TK1_U14, PC20_ISI_D1_TF1_V11, PC21_ISI_D2_TD1_U15, PC22_ISI_D3_RF1_T15, PC23_ISI_D4_RD1_U16, PC24_ISI_D5_RK1_PCK1_T16, PC25_ISI_D6_TWD3_URXD1_V17, PC26_ISI_D7_TWCK3_UTXD1_R16, PC27_AD0_SPI0_NPCS1_PWML0_U12, PC28_AD1_SPI0_NPCS2_PWML1_T11, PC29_AD2_SPI0_NPCS3_PWMFI0_R13, PC30_AD3_PWMH0_T12, PC31_AD4_PWMH1_T13, PD8_PCK0_M1, PD9_FIQ_M2, PD10_CTS0_N2, PD11_RTS0_SPI2_MISO_N3, PD12_RXD0_N1, PD13_TXD0_SPI2_MOSI_P3, PD14_CTS1_P2, PD15_RTS1_SPI2_SPCK_N4, PD16_RXD1_R2, PD17_TXD1_SPI2_NPCS0_R3, PD19_P11, PD20_T10, PD21_P10, PD22_U11, PD23_R10, PD24_U10, PD25_R11, PD26_U13, PD27_T14, PD28_SCK0_R1, PD29_SCK1_P1, PD31_SPI0_NPCS2_PCK1_P5, PE0_MCI0_CDB_CTS4_W19_INT, PE1_MCI0_DB0_U17_INT, PE2_MCI0_DB1_T17_INT, PE3_MCI0_DB2_P16_INT, PE4_MCI0_DB3_U18_INT, PE5_CTS3_R17, PE6_TIOA3_V19, PE7_TIOB3_PWMFI1_U19, PE8_TCLK3_PWML3_T19_INT, PE9_TIOA2_T18, PE10_TIOB2_N14, PE11_TCLK2_R18, PE12_TIOA1_PWMH2_P17, PE13_TIOB1_PWML2_P18, PE14_TCLK1_PWMH3_N17, PE15_SCK3_TIOA0_N18, PE16_RXD3_TIOB0_M15, PE17_TXD3_TCLK0_N19, PE18_TIOA5_MCI1_CK_P19, PE19_TIOB5_MCI1_CDA_N16, PE20_TCLK5_MCI1_DA0_M14, PE21_TIOA4_MCI1_DA1_M18, PE22_TIOB4_MCI1_DA2_M19, PE23_TCLK4_MCI_DA3_L18, PE24_RTS3_L19, PE25_SCK4_IRQ_M17, PE26_RXD4_L15, PE27_TXD4_M16, PE28_RTS4_L17, PE29_DIBP_URXD0_TWD1_V1, PE30_DIBN_UTXD0_TWCK1_U2, PE31_ADTRG_L4, PIOBU0_U3, PIOBU1, RESET, SHDN_T2, WKUP_V3

### Nets
+3.3V: L1.1
GND: C1.2 C2.2 U1.21(GND) U1.22(GND) U1.63(GND) U1.64(GND) U1.105(GND) U1.106(GND) U1.147(GND) U1.148(GND) U1.GND
VBatt: U1.126(VBATT)
ADCREF_EXT: U1.150(ADCREF_EXT) ; port ADCREF_EXT
BOOT_RECOVERY: U1.152(BOOT_RECOVERY) ; port BOOT_RECOVERY
ETH_LEDACTLINK: U1.77(ETH_LEDACTLINK) ; port ETH_LEDACTLINK
ETH_LEDSPEED: U1.76(ETH_LEDSPEED) ; port ETH_LEDSPEED
ETHRX_N: U1.78(ETH_RXN) ; port ETHRX_N
ETHRX_P: U1.79(ETH_RXP) ; port ETHRX_P
ETHTX_N: U1.80(ETH_TXN) ; port ETHTX_N
ETHTX_P: U1.81(ETH_TXP) ; port ETHTX_P
JTAGSEL_V2: U1.131(JTAGSEL_V2) ; port JTAGSEL_V2
PA0_LCDDAT0_TMS_A7: U1.61(PA0_LCDDAT0_TMS_A7) ; port PA0_LCDDAT0_TMS_A7
PA1_LCDDAT1_F6: U1.51(PA1_LCDDAT1_F6) ; port PA1_LCDDAT1_F6
PA2_LCDDAT2_G1_TXCK_E6: U1.53(PA2_LCDDAT2_G1_TXCK_E6) ; port PA2_LCDDAT2_G1_TXCK_E6
PA3_LCDDAT3_G1_RXCK_C6: U1.57(PA3_LCDDAT3_G1_RXCK_C6) ; port PA3_LCDDAT3_G1_RXCK_C6
PA4_LCDDAT4_G1_TXEN_D6: U1.55(PA4_LCDDAT4_G1_TXEN_D6) ; port PA4_LCDDAT4_G1_TXEN_D6
PA5_LCDDAT5_G1_TXER_B6: U1.59(PA5_LCDDAT5_G1_TXER_B6) ; port PA5_LCDDAT5_G1_TXER_B6
PA6_LCDDAT6_G1_CRS_A6: U1.62(PA6_LCDDAT6_G1_CRS_A6) ; port PA6_LCDDAT6_G1_CRS_A6
PA7_LCDDAT7_E5: U1.50(PA7_LCDDAT7_E5) ; port PA7_LCDDAT7_E5
PA8_LCDDAT8_TCK_A5: U1.65(PA8_LCDDAT8_TCK_A5) ; port PA8_LCDDAT8_TCK_A5
PA9_LCDDAT9_G1_COL_F4: U1.72(PA9_LCDDAT9_G1_COL_F4) ; port PA9_LCDDAT9_G1_COL_F4
PA10_LCDDAT10_G1_RXDV_F5: U1.49(PA10_LCDDAT10_G1_RXDV_F5) ; port PA10_LCDDAT10_G1_RXDV_F5
PA11_LCDDAT11_G1_RXER_D5: U1.54(PA11_LCDDAT11_G1_RXER_D5) ; port PA11_LCDDAT11_G1_RXER_D5
PA12_LCDDAT12_G1_RX0_G5: U1.47(PA12_LCDDAT12_G1_RX0_G5) ; port PA12_LCDDAT12_G1_RX0_G5
PA13_LCDDAT13_G1_RX1_C5: U1.58(PA13_LCDDAT13_G1_RX1_C5) ; port PA13_LCDDAT13_G1_RX1_C5
PA14_LCDDAT14_G1_TX0_E4: U1.52(PA14_LCDDAT14_G1_TX0_E4) ; port PA14_LCDDAT14_G1_TX0_E4
PA15_LCDDAT15_G1_TX1_B5: U1.60(PA15_LCDDAT15_G1_TX1_B5) ; port PA15_LCDDAT15_G1_TX1_B5
PA16_LCDDAT16_NTRST_H6: U1.48(PA16_LCDDAT16_NTRST_H6) ; port PA16_LCDDAT16_NTRST_H6
PA17_LCDDAT17_D4: U1.71(PA17_LCDDAT17_D4) ; port PA17_LCDDAT17_D4
PA18_LCDDAT18_G1_RX2_G4: U1.75(PA18_LCDDAT18_G1_RX2_G4) ; port PA18_LCDDAT18_G1_RX2_G4
PA19_LCDDAT19_G1_RX3_C4: U1.68(PA19_LCDDAT19_G1_RX3_C4) ; port PA19_LCDDAT19_G1_RX3_C4
PA20_LCDDAT20_G1_TX2_A3: U1.69(PA20_LCDDAT20_G1_TX2_A3) ; port PA20_LCDDAT20_G1_TX2_A3
PA21_LCDDAT21_G1_TX3_B4: U1.66(PA21_LCDDAT21_G1_TX3_B4) ; port PA21_LCDDAT21_G1_TX3_B4
PA22_LCDDAT22_G1_MDC_B3: U1.70(PA22_LCDDAT22_G1_MDC_B3) ; port PA22_LCDDAT22_G1_MDC_B3
PA23_LCDDAT23_G1_MDIO_A4: U1.67(PA23_LCDDAT23_G1_MDIO_A4) ; port PA23_LCDDAT23_G1_MDIO_A4
PA24_LCDPWM_PCK0_H5: U1.45(PA24_LCDPWM_PCK0_H5) ; port PA24_LCDPWM_PCK0_H5
PA25_LCDDISP_TD0_F3: U1.73(PA25_LCDDISP_TD0_F3) ; port PA25_LCDDISP_TD0_F3
PA26_LCDVSYNC_PWMH0_SP1_NPCS1_E3: U1.56(PA26_LCDVSYNC_PWMH0_SP1_NPCS1_E3) ; port PA26_LCDVSYNC_PWMH0_SP1_NPCS1_E3
PA27_LCDHSYNC_PWML0_SPI1_NPCS2_H4: U1.44(PA27_LCDHSYNC_PWML0_SPI1_NPCS2_H4) ; port PA27_LCDHSYNC_PWML0_SPI1_NPCS2_H4
PA28_LCDPCK_PWMH1_SP1_NPCS3_G3: U1.74(PA28_LCDPCK_PWMH1_SP1_NPCS3_G3) ; port PA28_LCDPCK_PWMH1_SP1_NPCS3_G3
PA29_LCDDEN_PWML1_J5: U1.46(PA29_LCDDEN_PWML1_J5) ; port PA29_LCDDEN_PWML1_J5
PA30_TWD0_D3: U1.140(PA30_TWD0_D3) ; port PA30_TWD0_D3
PA31_TWCK0_J4: U1.139(PA31_TWCK0_J4) ; port PA31_TWCK0_J4
PB1_G0_RXCK_SCK2_ISI_PCK_A2: U1.93(PB1_G0_RXCK_SCK2_ISI_PCK_A2) ; port PB1_G0_RXCK_SCK2_ISI_PCK_A2
PB3_G0_TXER_CTS2_ISI_VSYNC_C2: U1.94(PB3_G0_TXER_CTS2_ISI_VSYNC_C2) ; port PB3_G0_TXER_CTS2_ISI_VSYNC_C2
PB4_G0_CRS_RXD2_ISI_HSYNC_J3: U1.107(PB4_G0_CRS_RXD2_ISI_HSYNC_J3) ; port PB4_G0_CRS_RXD2_ISI_HSYNC_J3
PB5_G0_COL_TXD2_PCK2_H2: U1.102(PB5_G0_COL_TXD2_PCK2_H2) ; port PB5_G0_COL_TXD2_PCK2_H2
PB10_G0_RX2_PCK2_PWML1_F1: U1.100(PB10_G0_RX2_PCK2_PWML1_F1) ; port PB10_G0_RX2_PCK2_PWML1_F1
PB11_G0_RX3_RTS2_PWMH1_K4: U1.108(PB11_G0_RX3_RTS2_PWMH1_K4) ; port PB11_G0_RX3_RTS2_PWMH1_K4
PB14_G0_TX2_SPI2_NPCS1_PWMH0_A1: U1.97(PB14_G0_TX2_SPI2_NPCS1_PWMH0_A1) ; port PB14_G0_TX2_SPI2_NPCS1_PWMH0_A1
PB15_G0_TX3_SPI2_NPCS2_PWML0_E2: U1.99(PB15_G0_TX3_SPI2_NPCS2_PWML0_E2) ; port PB15_G0_TX3_SPI2_NPCS2_PWML0_E2
PB18_SPI1_MISO_K2: U1.110(PB18_SPI1_MISO_K2) ; port PB18_SPI1_MISO_K2
PB19_SPI1_MOSI_C1: U1.95(PB19_SPI1_MOSI_C1) ; port PB19_SPI1_MOSI_C1
PB20_SPI1_SPCK__D1: U1.96(PB20_SPI1_SPCK__D1) ; port PB20_SPI1_SPCK__D1
PB21_SPI1_NPCS0_L3: U1.111(PB21_SPI1_NPCS0_L3) ; port PB21_SPI1_NPCS0_L3
PB22_SPI1_NPCS1_G1: U1.101(PB22_SPI1_NPCS1_G1) ; port PB22_SPI1_NPCS1_G1
PB23_SPI1_NPCS2_H1: U1.103(PB23_SPI1_NPCS2_H1) ; port PB23_SPI1_NPCS2_H1
PB24_DRXD_TDI_E1: U1.98(PB24_DRXD_TDI_E1) ; port PB24_DRXD_TDI_E1
PB25_DTXD_TDO_J1: U1.104(PB25_DTXD_TDO_J1) ; port PB25_DTXD_TDO_J1
PB26_PCK0_RK0_PWMH0_M5: U1.157(PB26_PCK0_RK0_PWMH0_M5) ; port PB26_PCK0_RK0_PWMH0_M5
PB27_SPI1_NPCS3_TK0_PWML0_L2: U1.113(PB27_SPI1_NPCS3_TK0_PWML0_L2) ; port PB27_SPI1_NPCS3_TK0_PWML0_L2
PB28_SPI2_NPCS3_TD0_PWMH1_K1: U1.109(PB28_SPI2_NPCS3_TD0_PWMH1_K1) ; port PB28_SPI2_NPCS3_TD0_PWMH1_K1
PB29_TWD2_RD0_PWML1_M3: U1.137(PB29_TWD2_RD0_PWML1_M3) ; port PB29_TWD2_RD0_PWML1_M3
PB30_TWCK2_RF0_M4: U1.129(PB30_TWCK2_RF0_M4) ; port PB30_TWCK2_RF0_M4
PB31_TF0_L1: U1.112(PB31_TF0_L1) ; port PB31_TF0_L1
PC0_SPI0_MISO_PWMH2_ISI_D8: U1.153(PC0_SPI0_MISO_PWMH2_ISI_D8) ; port PC0_SPI0_MISO_PWMH2_ISI_D8
PC1_SPI0_MOSI_PWML2_ISI_D9_P8: U1.159(PC1_SPI0_MOSI_PWML2_ISI_D9_P8) ; port PC1_SPI0_MOSI_PWML2_ISI_D9_P8
PC2_SPI0_SPCK_PWMH3_ISI_D10_V5: U1.151(PC2_SPI0_SPCK_PWMH3_ISI_D10_V5) ; port PC2_SPI0_SPCK_PWMH3_ISI_D10_V5
PC3_SPI0_NPCS0_PWML3_ISI_D11_T9: U1.2(PC3_SPI0_NPCS0_PWML3_ISI_D11_T9) ; port PC3_SPI0_NPCS0_PWML3_ISI_D11_T9
PC4_SPI0_NPCS1_MCI0_CK_PCK1_W5_INT: U1.138(PC4_SPI0_NPCS1_MCI0_CK_PCK1_W5) ; port PC4_SPI0_NPCS1_MCI0_CK_PCK1_W5_INT
PC19_ISI_D0_TK1_U14: U1.7(PC19_ISI_D0_TK1_U14) ; port PC19_ISI_D0_TK1_U14
PC20_ISI_D1_TF1_V11: U1.3(PC20_ISI_D1_TF1_V11) ; port PC20_ISI_D1_TF1_V11
PC21_ISI_D2_TD1_U15: U1.8(PC21_ISI_D2_TD1_U15) ; port PC21_ISI_D2_TD1_U15
PC22_ISI_D3_RF1_T15: U1.161(PC22_ISI_D3_RF1_T15) ; port PC22_ISI_D3_RF1_T15
PC23_ISI_D4_RD1_U16: U1.10(PC23_ISI_D4_RD1_U16) ; port PC23_ISI_D4_RD1_U16
PC24_ISI_D5_RK1_PCK1_T16: U1.9(PC24_ISI_D5_RK1_PCK1_T16) ; port PC24_ISI_D5_RK1_PCK1_T16
PC25_ISI_D6_TWD3_URXD1_V17: U1.25(PC25_ISI_D6_TWD3_URXD1_V17) ; port PC25_ISI_D6_TWD3_URXD1_V17
PC26_ISI_D7_TWCK3_UTXD1_R16: U1.11(PC26_ISI_D7_TWCK3_UTXD1_R16) ; port PC26_ISI_D7_TWCK3_UTXD1_R16
PC27_AD0_SPI0_NPCS1_PWML0_U12: U1.136(PC27_AD0_SPI0_NPCS1_PWML0_U12) ; port PC27_AD0_SPI0_NPCS1_PWML0_U12
PC28_AD1_SPI0_NPCS2_PWML1_T11: U1.134(PC28_AD1_SPI0_NPCS2_PWML1_T11) ; port PC28_AD1_SPI0_NPCS2_PWML1_T11
PC29_AD2_SPI0_NPCS3_PWMFI0_R13: U1.16(PC29_AD2_SPI0_NPCS3_PWMFI0_R13) ; port PC29_AD2_SPI0_NPCS3_PWMFI0_R13
PC30_AD3_PWMH0_T12: U1.1(PC30_AD3_PWMH0_T12) ; port PC30_AD3_PWMH0_T12
PC31_AD4_PWMH1_T13: U1.6(PC31_AD4_PWMH1_T13) ; port PC31_AD4_PWMH1_T13
PD8_PCK0_M1: U1.114(PD8_PCK0_M1) ; port PD8_PCK0_M1
PD9_FIQ_M2: U1.115(PD9_FIQ_M2) ; port PD9_FIQ_M2
PD10_CTS0_N2: U1.118(PD10_CTS0_N2) ; port PD10_CTS0_N2
PD11_RTS0_SPI2_MISO_N3: U1.119(PD11_RTS0_SPI2_MISO_N3) ; port PD11_RTS0_SPI2_MISO_N3
PD12_RXD0_N1: U1.117(PD12_RXD0_N1) ; port PD12_RXD0_N1
PD13_TXD0_SPI2_MOSI_P3: U1.120(PD13_TXD0_SPI2_MOSI_P3) ; port PD13_TXD0_SPI2_MOSI_P3
PD14_CTS1_P2: U1.130(PD14_CTS1_P2) ; port PD14_CTS1_P2
PD15_RTS1_SPI2_SPCK_N4: U1.155(PD15_RTS1_SPI2_SPCK_N4) ; port PD15_RTS1_SPI2_SPCK_N4
PD16_RXD1_R2: U1.127(PD16_RXD1_R2) ; port PD16_RXD1_R2
PD17_TXD1_SPI2_NPCS0_R3: U1.128(PD17_TXD1_SPI2_NPCS0_R3) ; port PD17_TXD1_SPI2_NPCS0_R3
PD19_P11: U1.168(PD19_P11) ; port PD19_P11
PD20_T10: U1.158(PD20_T10) ; port PD20_T10
PD21_P10: U1.165(PD21_P10) ; port PD21_P10
PD22_U11: U1.4(PD22_U11) ; port PD22_U11
PD23_R10: U1.166(PD23_R10) ; port PD23_R10
PD24_U10: U1.167(PD24_U10) ; port PD24_U10
PD25_R11: U1.5(PD25_R11) ; port PD25_R11
PD26_U13: U1.133(PD26_U13) ; port PD26_U13
PD27_T14: U1.160(PD27_T14) ; port PD27_T14
PD28_SCK0_R1: U1.122(PD28_SCK0_R1) ; port PD28_SCK0_R1
PD29_SCK1_P1: U1.121(PD29_SCK1_P1) ; port PD29_SCK1_P1
PD31_SPI0_NPCS2_PCK1_P5: U1.156(PD31_SPI0_NPCS2_PCK1_P5) ; port PD31_SPI0_NPCS2_PCK1_P5
PE0_MCI0_CDB_CTS4_W19_INT: U1.28(PE0_MCI0_CDB_CTS4_W19) ; port PE0_MCI0_CDB_CTS4_W19_INT
PE1_MCI0_DB0_U17_INT: U1.23(PE1_MCI0_DB0_U17) ; port PE1_MCI0_DB0_U17_INT
PE2_MCI0_DB1_T17_INT: U1.26(PE2_MCI0_DB1_T17) ; port PE2_MCI0_DB1_T17_INT
PE3_MCI0_DB2_P16_INT: U1.12(PE3_MCI0_DB2_P16) ; port PE3_MCI0_DB2_P16_INT
PE4_MCI0_DB3_U18_INT: U1.19(PE4_MCI0_DB3_U18) ; port PE4_MCI0_DB3_U18_INT
PE5_CTS3_R17: U1.20(PE5_CTS3_R17) ; port PE5_CTS3_R17
PE6_TIOA3_V19: U1.30(PE6_TIOA3_V19) ; port PE6_TIOA3_V19
PE7_TIOB3_PWMFI1_U19: U1.31(PE7_TIOB3_PWMFI1_U19) ; port PE7_TIOB3_PWMFI1_U19
PE8_TCLK3_PWML3_T19_INT: U1.24(PE8_TCLK3_PWML3_T19) ; port PE8_TCLK3_PWML3_T19_INT
PE9_TIOA2_T18: U1.32(PE9_TIOA2_T18) ; port PE9_TIOA2_T18
PE10_TIOB2_N14: U1.164(PE10_TIOB2_N14) ; port PE10_TIOB2_N14
PE11_TCLK2_R18: U1.36(PE11_TCLK2_R18) ; port PE11_TCLK2_R18
PE12_TIOA1_PWMH2_P17: U1.27(PE12_TIOA1_PWMH2_P17) ; port PE12_TIOA1_PWMH2_P17
PE13_TIOB1_PWML2_P18: U1.34(PE13_TIOB1_PWML2_P18) ; port PE13_TIOB1_PWML2_P18
PE14_TCLK1_PWMH3_N17: U1.29(PE14_TCLK1_PWMH3_N17) ; port PE14_TCLK1_PWMH3_N17
PE15_SCK3_TIOA0_N18: U1.39(PE15_SCK3_TIOA0_N18) ; port PE15_SCK3_TIOA0_N18
PE16_RXD3_TIOB0_M15: U1.14(PE16_RXD3_TIOB0_M15) ; port PE16_RXD3_TIOB0_M15
PE17_TXD3_TCLK0_N19: U1.38(PE17_TXD3_TCLK0_N19) ; port PE17_TXD3_TCLK0_N19
PE18_TIOA5_MCI1_CK_P19: U1.35(PE18_TIOA5_MCI1_CK_P19) ; port PE18_TIOA5_MCI1_CK_P19
PE19_TIOB5_MCI1_CDA_N16: U1.18(PE19_TIOB5_MCI1_CDA_N16) ; port PE19_TIOB5_MCI1_CDA_N16
PE20_TCLK5_MCI1_DA0_M14: U1.13(PE20_TCLK5_MCI1_DA0_M14) ; port PE20_TCLK5_MCI1_DA0_M14
PE21_TIOA4_MCI1_DA1_M18: U1.41(PE21_TIOA4_MCI1_DA1_M18) ; port PE21_TIOA4_MCI1_DA1_M18
PE22_TIOB4_MCI1_DA2_M19: U1.40(PE22_TIOB4_MCI1_DA2_M19) ; port PE22_TIOB4_MCI1_DA2_M19
PE23_TCLK4_MCI_DA3_L18: U1.43(PE23_TCLK4_MCI_DA3_L18) ; port PE23_TCLK4_MCI_DA3_L18
PE24_RTS3_L19: U1.33(PE24_RTS3_L19) ; port PE24_RTS3_L19
PE25_SCK4_IRQ_M17: U1.37(PE25_SCK4_IRQ_M17) ; port PE25_SCK4_IRQ_M17
PE26_RXD4_L15: U1.15(PE26_RXD4_L15) ; port PE26_RXD4_L15
PE27_TXD4_M16: U1.17(PE27_TXD4_M16) ; port PE27_TXD4_M16
PE28_RTS4_L17: U1.42(PE28_RTS4_L17) ; port PE28_RTS4_L17
PE29_DIBP_URXD0_TWD1_V1: U1.123(PE29_DIBP_URXD0_TWD1_V1) ; port PE29_DIBP_URXD0_TWD1_V1
PE30_DIBN_UTXD0_TWCK1_U2: U1.125(PE30_DIBN_UTXD0_TWCK1_U2) ; port PE30_DIBN_UTXD0_TWCK1_U2
PE31_ADTRG_L4: U1.116(PE31_ADTRG_L4) ; port PE31_ADTRG_L4
PIOBU0_U3: U1.135(PIOBU0_U3) ; port PIOBU0_U3
PIOBU1: U1.154(PIOBU1) ; port PIOBU1
RESET: U1.149(RESET) ; port RESET
SHDN_T2: U1.124(SHDN_T2) ; port SHDN_T2
usb1_n: U1.143(HHSDMB_V15) ; port HHSDMB_V15
usb1_p: U1.144(HHSDPB_W15) ; port HHSDPB_W15
usb2_n: U1.146(HHSDMC_V16) ; port HHSDMC_V16
usb2_p: U1.145(HHSDPC_W16) ; port HHSDPC_W16
usb_otg_n: U1.141(HHSDMA_DHSDM_V14) ; port HHSDMA_DHSDM_V14
usb_otg_p: U1.142(HHSDPA_DHSDP_W14) ; port HHSDPA_DHSDP_W14
WKUP_V3: U1.132(WKUP_V3) ; port WKUP_V3
NetC1_1: C1.1 C2.1 L1.2 U1.162(3V3) U1.163(3V3)

Not connected (* = marked no-connect by the designer): U1 82(NC) 83(NC) 84(NC) 85(NC) 86(NC) 87(NC) 88(NC) 89(NC) 90(NC) 91(NC) 92(NC)

### Layout directives
differential pair: ETHRX_N, ETHRX_P, ETHTX_N, ETHTX_P, usb1_n, usb1_p, usb2_n, usb2_p, usb_otg_n, usb_otg_p
net class LCD: (no net found under the mark)

### Notes on the sheet
- Title:
- Author:
- License:
- BSD
- Rev:
- Size:
- A3
- File:
- Date:
- Time:
- Sheet
- of

### Library data of the parts
C1 = Cap Pol1: Ceramic X5R 25V; Published: 8-Jun-2000; Revision: July-2002: Re-released for DXP Platform.; Publisher: Altium Limited; Value: 10uF
C2 = Cap: Ceramic X7R 50V; Value: 100pF; Published: 8-Jun-2000; LatestRevisionDate: 17-Jul-2002; LatestRevisionNote: Re-released for DXP Platform.; PackageReference: RAD-0.3; Publisher: Altium Limited; PackageDescription: Radial Cap, Thru-Hole; 2 Leads; 0.3 in Pin Spacing
L1 = Inductor: WE 742792022
U1 = develboard_pinout: Faster Little Linux Module; Symbol version: rev.0; Publish date: 26/10/2015; Family: BLUE

## Sheet usb_ethernet.SchDoc: DevelBoard EVA01 USB Host and Ethernet Connectors.
size A3; Author: Daniele Basile <asterix@develer.com>; Organization: Develer s.r.l.; Address1: via Mugellese 1/A; Address2: 50019 Campi Bisenzio; Address3: Firenze; Address4: ITALY; DocumentNumber: 5; Revision: A; SheetNumber: 5; SheetTotal: 6
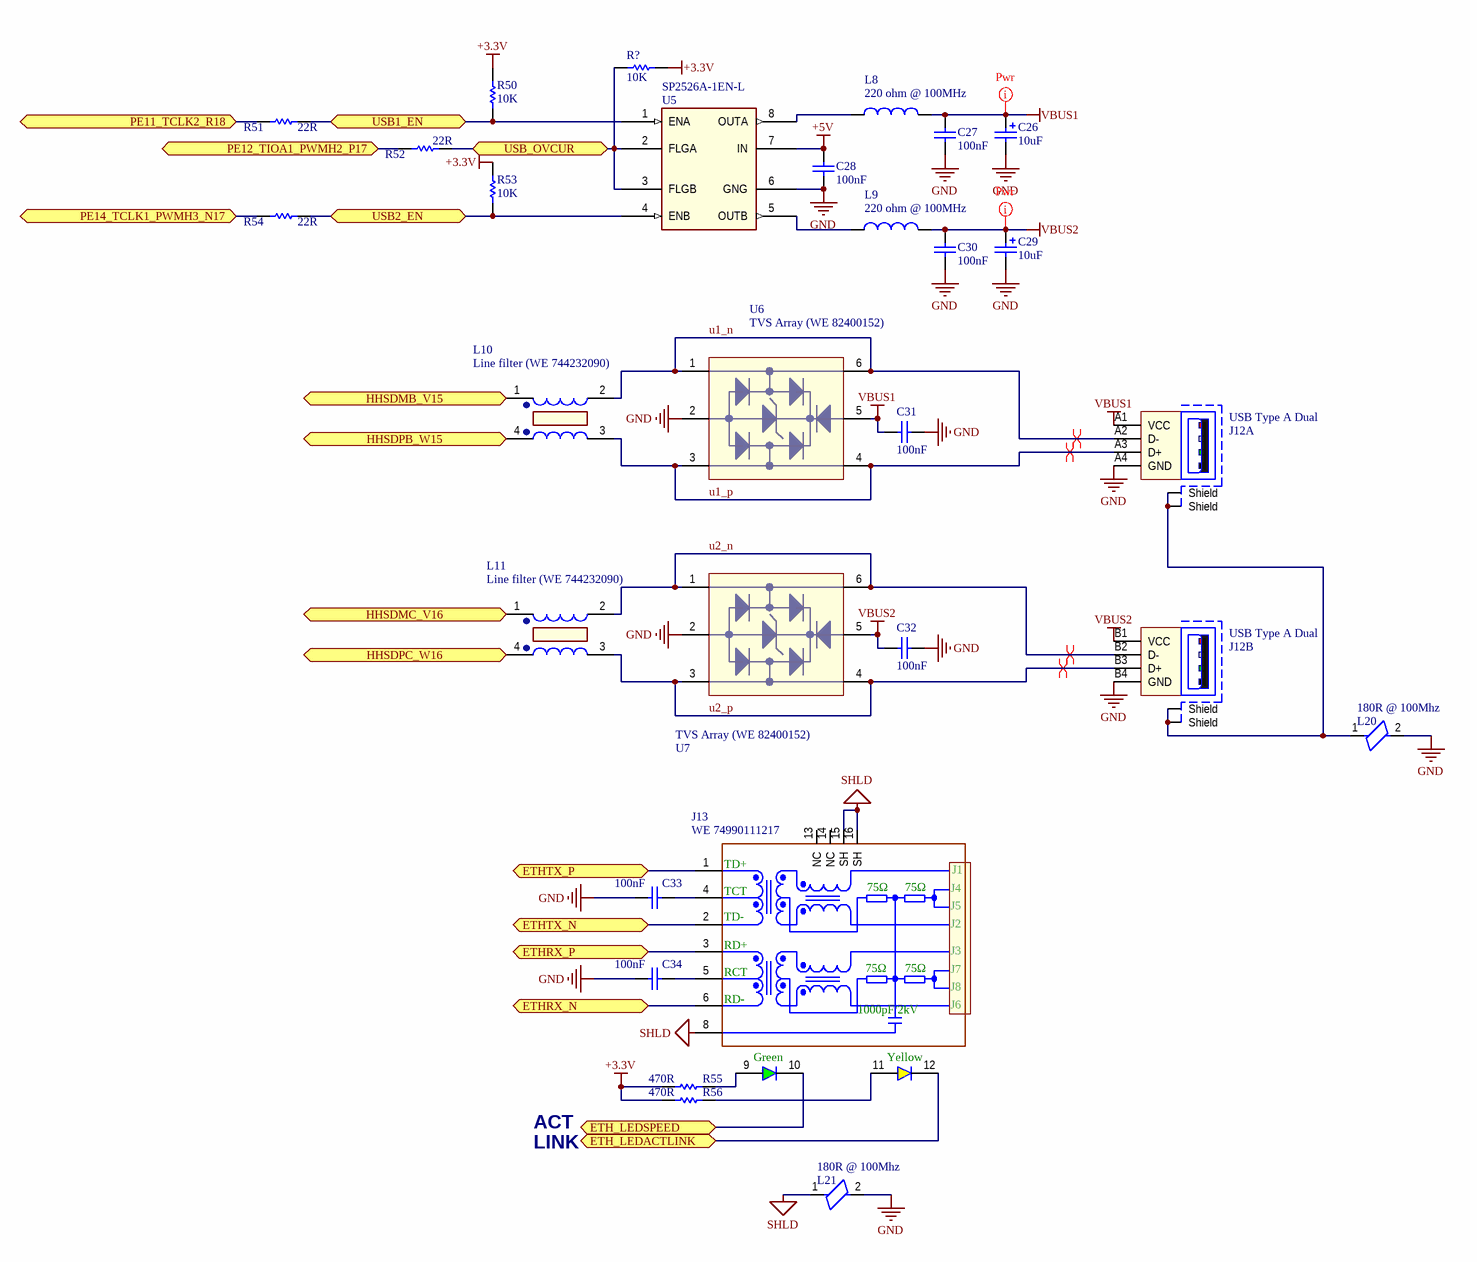
[diagram p3: usb_ethernet.SchDoc]

### Parts
(Parts that share a designator on the sheet are numbered #1, #2 ... from top to bottom, then left to right.)
C26  10uF  [1206_[3216]]
C27  100nF  [0603_[1608]]
C28  100nF  [0603_[1608]]
C29  10uF  [1206_[3216]]
C30  100nF  [0603_[1608]]
C31  100nF  [0603_[1608]]
C32  100nF  [0603_[1608]]
C33  100nF  [0603_[1608]]
C34  100nF  [0603_[1608]]
J12  USB Type A Dual  [USB_TypeA_Double_THD]  (parts A,B of 2)
J13  WE 74990111217  [RJ45_lan_transformer_horizontal]
L8  220 ohm @ 100MHz  [0805_[2012]]
L9  220 ohm @ 100MHz  [0805_[2012]]
L10  Line filter (WE 744232090)  [WE-CNSW_1206]
L11  Line filter (WE 744232090)  [WE-CNSW_1206]
L20  180R @ 100Mhz  [0603_[1608]]
L21  180R @ 100Mhz  [0603_[1608]]
R50  10K  [0603_[1608]]
R51  22R  [0603_[1608]]
R52  22R  [0603_[1608]]
R53  10K  [0603_[1608]]
R54  22R  [0603_[1608]]
R55  470R  [0603_[1608]]
R56  470R  [0603_[1608]]
R?#3  10K  [0603_[1608]]
U5  SP2526A-1EN-L  [SOIC8]
U6  TVS Array (WE 82400152)  [SOT-563]
U7  TVS Array (WE 82400152)  [SOT-563]

### Ports
ETH_LEDACTLINK, ETH_LEDSPEED, ETHRX_N, ETHRX_P, ETHTX_N, ETHTX_P, HHSDMB_V15, HHSDMC_V16, HHSDPB_W15, HHSDPC_W16, PE11_TCLK2_R18, PE12_TIOA1_PWMH2_P17, PE14_TCLK1_PWMH3_N17, USB1_EN, USB2_EN, USB_OVCUR

### Nets
+3.3V: R50.1 R53.1 R55.2 R56.2 R?#3.1
+5V: C28.1 U5.7(IN)
GND: C26.2 C27.2 C28.2 C29.2 C30.2 C31.1 C32.1 C33.2 C34.2 J12.A4(GND) J12.B4(GND) L20.2 L21.2 U5.6(GNG) U6.2 U7.2
SHLD: J13.8(SHLD) J13.15(SH) J13.16(SH) L21.1
VBUS1: C26.1 C27.1 C31.2 J12.A1(VCC) L8.1 U6.5
VBUS2: C29.1 C30.1 C32.2 J12.B1(VCC) L9.1 U7.5
ETH_LEDACTLINK: J13.12(Kg) ; port ETH_LEDACTLINK
ETH_LEDSPEED: J13.10(Ky) ; port ETH_LEDSPEED
ETHRX_N: J13.6(RD-) ; port ETHRX_N
ETHRX_P: J13.3(RD+) ; port ETHRX_P
ETHTX_N: J13.2(TD-) ; port ETHTX_N
ETHTX_P: J13.1(TD+) ; port ETHTX_P
PE11_TCLK2_R18: R51.1 ; port PE11_TCLK2_R18
PE12_TIOA1_PWMH2_P17: R52.1 ; port PE12_TIOA1_PWMH2_P17
PE14_TCLK1_PWMH3_N17: R54.1 ; port PE14_TCLK1_PWMH3_N17
u1_n: J12.A2(D-) L10.2 U6.1 U6.6
u1_p: J12.A3(D+) L10.3 U6.3 U6.4
u2_n: J12.B2(D-) L11.2 U7.1 U7.6
u2_p: J12.B3(D+) L11.3 U7.3 U7.4
USB1_EN: R50.2 R51.2 U5.1(ENA) ; port USB1_EN
usb1_n: L10.1 ; port HHSDMB_V15
usb1_p: L10.4 ; port HHSDPB_W15
USB2_EN: R53.2 R54.2 U5.4(ENB) ; port USB2_EN
usb2_n: L11.1 ; port HHSDMC_V16
usb2_p: L11.4 ; port HHSDPC_W16
USB_OVCUR: R52.2 R?#3.2 U5.2(FLGA) U5.3(FLGB) ; port USB_OVCUR
NetC33_1: C33.1 J13.4(TCT)
NetC34_1: C34.1 J13.5(RCT)
NetJ12_Z1: J12.Z1(Shield) J12.Z2(Shield) J12.Z3(Shield) J12.Z4(Shield) L20.1
NetJ13_9: J13.9(Ay) R55.1
NetJ13_11: J13.11(Ag) R56.1
NetL8_2: L8.2 U5.8(OUTA)
NetL9_2: L9.2 U5.5(OUTB)

Not connected (* = marked no-connect by the designer): J13 13(NC) 14(NC)

### Layout directives
net class Power: VBUS1, VBUS2
differential pair: u1_n, u1_p, u2_n, u2_p

### Notes on the sheet
- ACT
- LINK
- Title:
- Author:
- License:
- BSD
- Rev:
- Size:
- A3
- File:
- Date:
- Time:
- Sheet
- of
- (in symbol RJ45LAN-10/100BaseT) J1; 75Ω; J4; J5; J2; J3; J7; J8; J6; 1000pF/2kV; Green; Yellow

### Library data of the parts
C26 C29 = Cap Pol1: Ceramic X5R 25V; Published: 8-Jun-2000; Revision: July-2002: Re-released for DXP Platform.; Publisher: Altium Limited; Value: 10uF
C27 C28 C30-C32 = Cap: Ceramic X7R 50V; Value: 100pF; Published: 8-Jun-2000; LatestRevisionDate: 17-Jul-2002; LatestRevisionNote: Re-released for DXP Platform.; PackageReference: RAD-0.3; Publisher: Altium Limited; PackageDescription: Radial Cap, Thru-Hole; 2 Leads; 0.3 in Pin Spacing
C33 C34 = Cap: Capacitor; Value: 10nF; Published: 8-Jun-2000; Revision: July-2002: Re-released for DXP Platform.; Publisher: Altium Limited
J12 = WE-Communication Connectors 61400826021: USB Type-A Double Connector (WE  61400826021); Manufacturer: Würth Elektronik eiSos GmbH; ComponentLink1 Description: Manufacturer; ComponentLink2 Description: Datasheet; NoPins: 8; ComponentLink1URL: http://www.we-online.de; ComponentLink2URL: http://katalog.we-online.de/em/datasheet/61400826021.pdf; Created by: Karrer Zheng; Created Date: 10/10/2014; partNo: 61400826021
J13 = RJ45LAN-10/100BaseT: Integrated RJ45 Transformer WE-RJ45LAN; PartNo: 74980111211; Manufacturer: Wurth Elektronik; E-mail: libraries@we-online.com; ComponentLink1Description: Manufacturer; ComponentLink1URL: http://www.we-online.de; Created by: Karrer Zheng; Created Date: Feb 2015; ComponentLink2Description: Datasheet; ComponentLink2URL: http://www.we-online.de/katalog/media/pdf/74980111211.pdf
L8 L9 = Inductor: WE 742792022
L10 L11 = Common_mode_choke: Common mode line filter
L20 L21 = BEAD_ FERRITE: Ferrite Beat (WE 7427927218)
R50-R56 R?#3 = Res1: Resistor; Value: 1K; Published: 8-Jun-2000; Revision: July-2002: Re-released for DXP Platform.; Publisher: Altium Limited
U6 U7 = TVS_Diode_Array

## Sheet sd_debug.SchDoc: DevelBoard EVA MicroSD and Debug.
size A3; Author: Daniele Basile <asterix@develer.com>; Organization: Develer s.r.l.; Address1: via Mugellese 1/A; Address2: 50019 Campi Bisenzio; Address3: Firenze; Address4: ITALY; DocumentNumber: 4; Revision: EVA 0; SheetNumber: 3; SheetTotal: 6
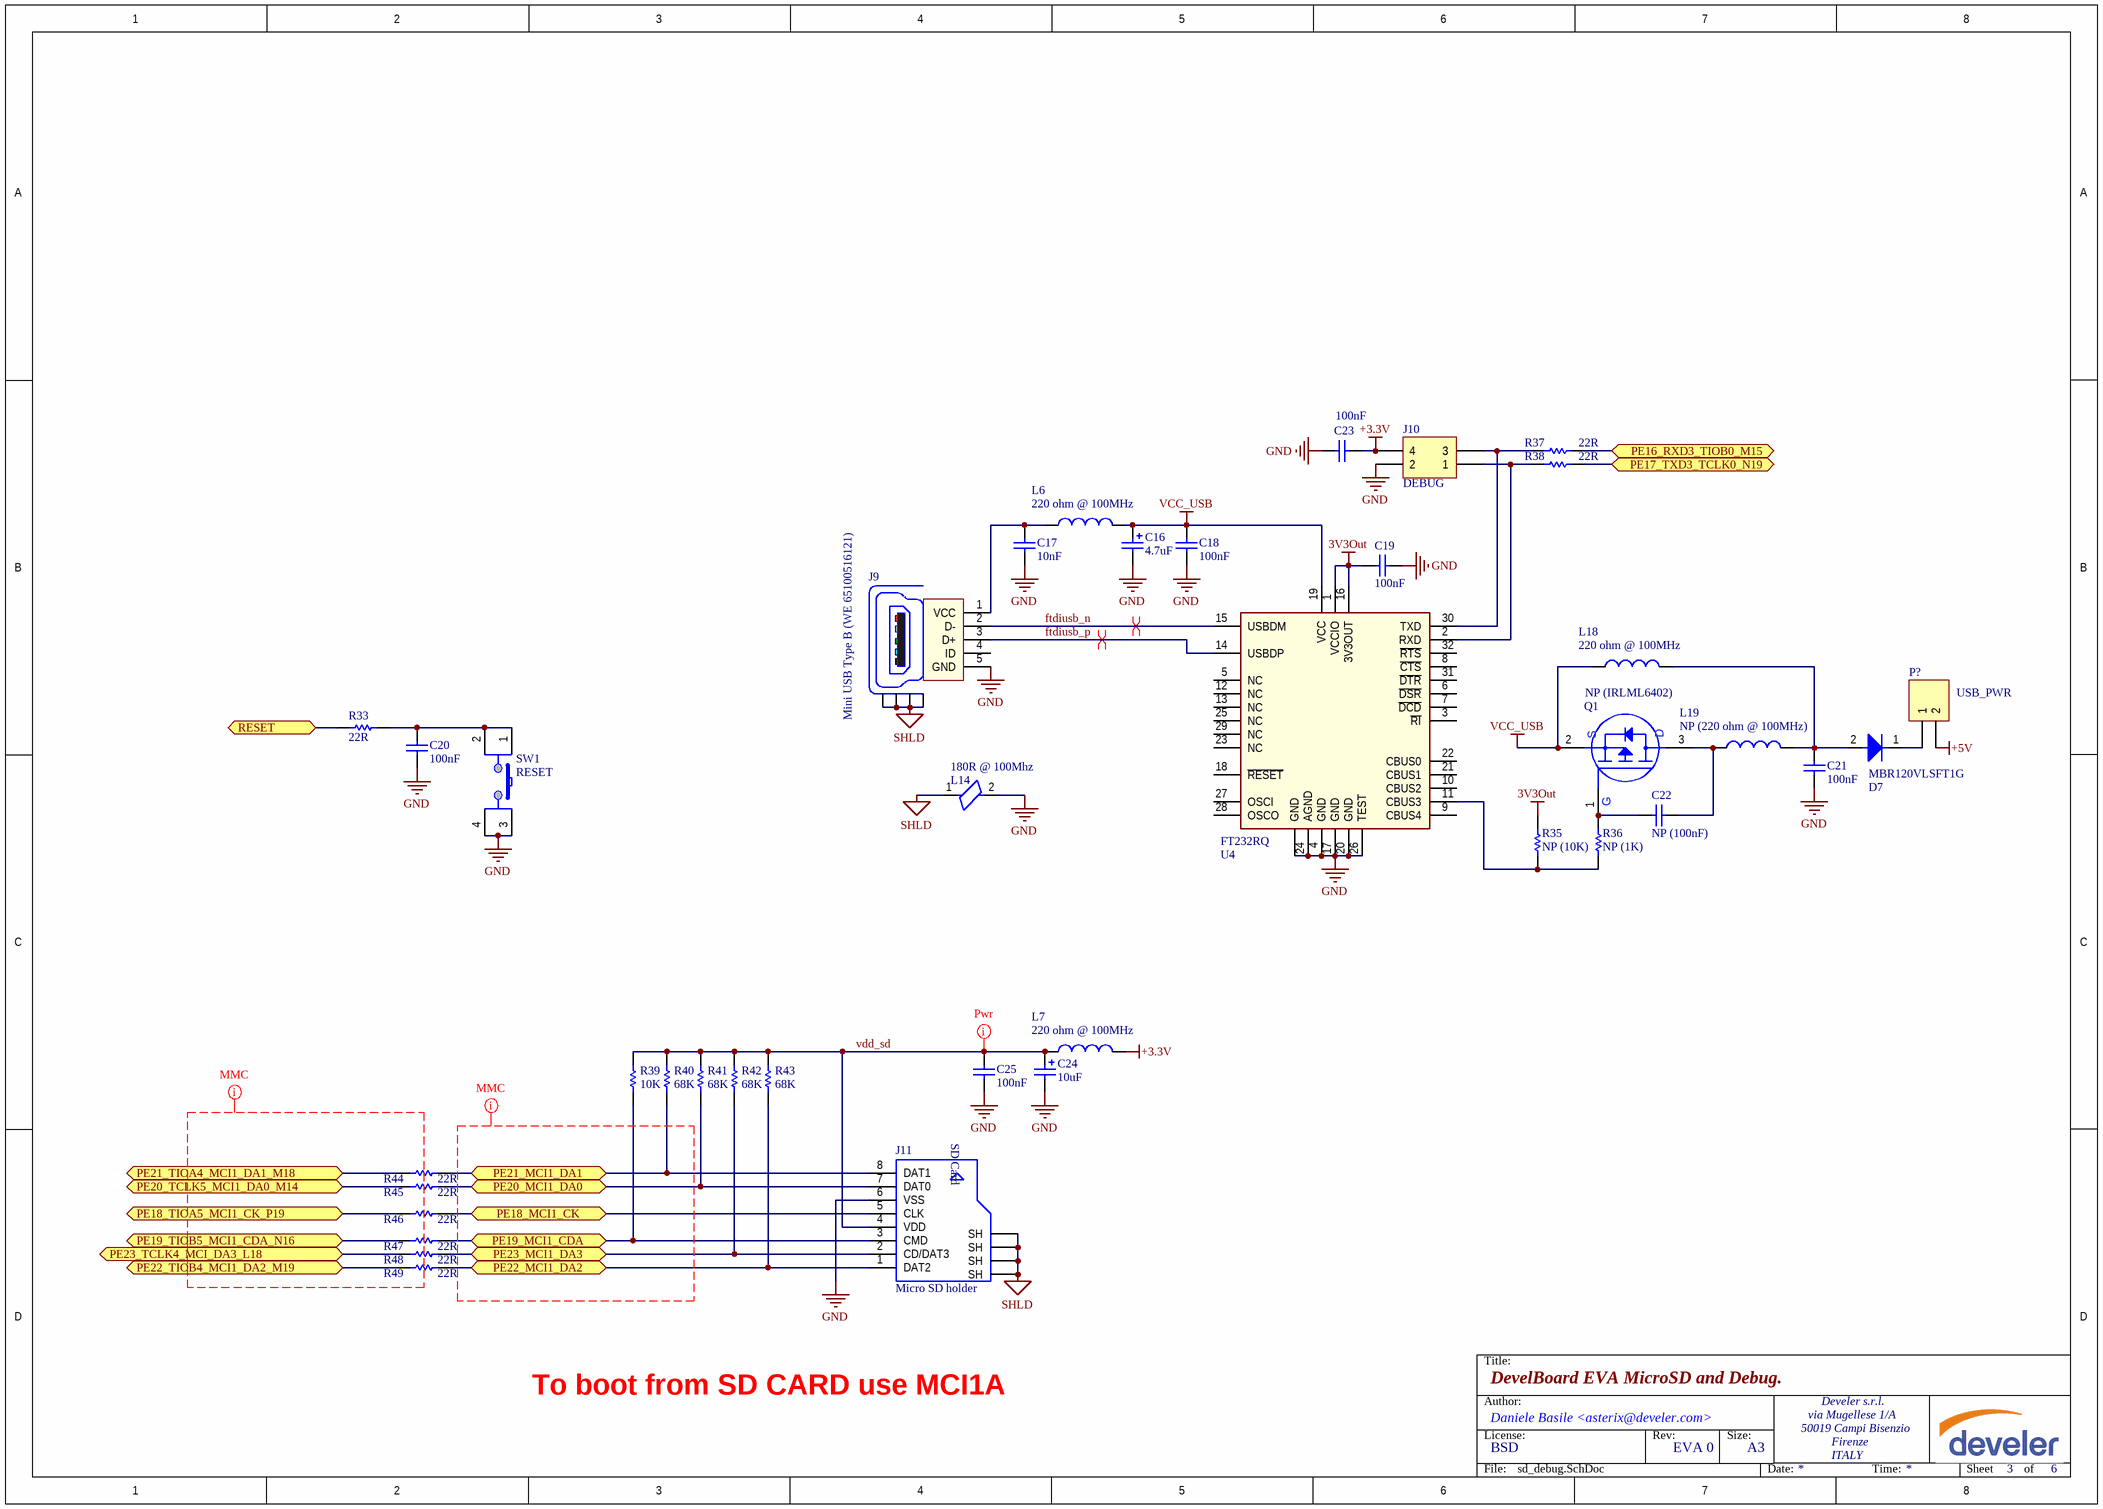
[diagram p4: sd_debug.SchDoc]

### Parts
(Parts that share a designator on the sheet are numbered #1, #2 ... from top to bottom, then left to right.)
C16  4.7uF  [1206_[3216]]
C17  10nF  [0603_[1608]]
C18  100nF  [0603_[1608]]
C19  100nF  [0603_[1608]]
C20  100nF  [0603_[1608]]
C21  100nF  [0603_[1608]]
C22  NP (100nF)  [0603_[1608]]
C23  100nF  [0603_[1608]]
C24  10uF  [1206_[3216]]
C25  100nF  [0603_[1608]]
D7  MBR120VLSFT1G  [SOD-123]
J9  Mini USB Type B (WE 65100516121)  [usb_typeB_mini_smd]
J10  DEBUG  [HEADER_2X2_2.54MM_THD]
J11  Micro SD holder  [micro_sd_holder_pp]
L6  220 ohm @ 100MHz  [0805_[2012]]
L7  220 ohm @ 100MHz  [0805_[2012]]
L14  180R @ 100Mhz  [0603_[1608]]
L18  220 ohm @ 100MHz  [0805_[2012]]
L19  NP (220 ohm @ 100MHz)  [0805_[2012]]
P?#2  USB_PWR  [HDR1X2]
Q1  NP (IRLML6402)
R33  22R  [0603_[1608]]
R35  NP (10K)  [0603_[1608]]
R36  NP (1K)  [0603_[1608]]
R37  22R  [0603_[1608]]
R38  22R  [0603_[1608]]
R39  10K  [0603_[1608]]
R40  68K  [0603_[1608]]
R41  68K  [0603_[1608]]
R42  68K  [0603_[1608]]
R43  68K  [0603_[1608]]
R44  22R  [0603_[1608]]
R45  22R  [0603_[1608]]
R46  22R  [0603_[1608]]
R47  22R  [0603_[1608]]
R48  22R  [0603_[1608]]
R49  22R  [0603_[1608]]
SW1  RESET  [TACTILE_SWITCH_6x6MM_SMD]
U4  FT232RQ  [QFN-32]

### Ports
PE16_RXD3_TIOB0_M15, PE17_TXD3_TCLK0_N19, PE18_MCI1_CK, PE18_TIOA5_MCI1_CK_P19, PE19_MCI1_CDA, PE19_TIOB5_MCI1_CDA_N16, PE20_MCI1_DA0, PE20_TCLK5_MCI1_DA0_M14, PE21_MCI1_DA1, PE21_TIOA4_MCI1_DA1_M18, PE22_MCI1_DA2, PE22_TIOB4_MCI1_DA2_M19, PE23_MCI1_DA3, PE23_TCLK4_MCI_DA3_L18, RESET

### Nets
3V3Out: C19.1 R35.1 U4.1(VCCIO) U4.16(3V3OUT)
+3.3V: C23.1 J10.4 L7.1
+5V: P?#2.2
GND: C16.2 C17.2 C18.2 C19.2 C20.1 C21.1 C23.2 C24.2 C25.2 J9.5(GND) J10.2 J11.6(VSS) L14.2 SW1.3 SW1.4 U4.4(GND) U4.17(GND) U4.20(GND) U4.24(AGND) U4.26(TEST) U4.GND_PAD(GND)
SHLD: J9.Z1(Shield) J9.Z2(Shield) J9.Z3(Shield) J9.Z4(Shield) J11.Z1(SH) J11.Z2(SH) J11.Z3(SH) J11.Z4(SH) L14.1
VCC_USB: C16.1 C18.1 L6.1 L18.2 Q1.2(S) U4.19(VCC)
ftdiusb_n: J9.2(D-) U4.15(USBDM)
ftdiusb_p: J9.3(D+) U4.14(USBDP)
PE16_RXD3_TIOB0_M15: R37.1 ; port PE16_RXD3_TIOB0_M15
PE17_TXD3_TCLK0_N19: R38.1 ; port PE17_TXD3_TCLK0_N19
PE18_MCI1_CK: J11.5(CLK) R46.2 ; port PE18_MCI1_CK
PE18_TIOA5_MCI1_CK_P19: R46.1 ; port PE18_TIOA5_MCI1_CK_P19
PE19_MCI1_CDA: J11.3(CMD) R39.2 R47.2 ; port PE19_MCI1_CDA
PE19_TIOB5_MCI1_CDA_N16: R47.1 ; port PE19_TIOB5_MCI1_CDA_N16
PE20_MCI1_DA0: J11.7(DAT0) R41.2 R45.2 ; port PE20_MCI1_DA0
PE20_TCLK5_MCI1_DA0_M14: R45.1 ; port PE20_TCLK5_MCI1_DA0_M14
PE21_MCI1_DA1: J11.8(DAT1) R40.2 R44.2 ; port PE21_MCI1_DA1
PE21_TIOA4_MCI1_DA1_M18: R44.1 ; port PE21_TIOA4_MCI1_DA1_M18
PE22_MCI1_DA2: J11.1(DAT2) R43.2 R49.2 ; port PE22_MCI1_DA2
PE22_TIOB4_MCI1_DA2_M19: R49.1 ; port PE22_TIOB4_MCI1_DA2_M19
PE23_MCI1_DA3: J11.2(CD/DAT3) R42.2 R48.2 ; port PE23_MCI1_DA3
PE23_TCLK4_MCI_DA3_L18: R48.1 ; port PE23_TCLK4_MCI_DA3_L18
RESET: R33.2 ; port RESET
vdd_sd: C24.1 C25.1 J11.4(VDD) L7.2 R39.1 R40.1 R41.1 R42.1 R43.1
NetC17_1: C17.1 J9.1(VCC) L6.2
NetC20_2: C20.2 R33.1 SW1.1 SW1.2
NetC21_2: C21.2 D7.2(A) L18.1 L19.1
NetC22_1: C22.1 Q1.1(G) R36.1
NetC22_2: C22.2 L19.2 Q1.3(D)
NetD7_1: D7.1(K) P?#2.1
NetJ10_1: J10.1 R38.2 U4.2(RXD)
NetJ10_3: J10.3 R37.2 U4.30(TXD)
NetR35_2: R35.2 R36.2 U4.11(CBUS3)

Not connected (* = marked no-connect by the designer): J9 4(ID); U4 3(~{RI}) 5(NC) 6(~{DSR}) 7(~{DCD}) 8(~{CTS}) 9(CBUS4) 10(CBUS2) 12(NC) 13(NC) 18(~{RESET}) 21(CBUS1) 22(CBUS0) 23(NC) 25(NC) 27(OSCI) 28(OSCO) 29(NC) 31(~{DTR}) 32(~{RTS})

### Layout directives
differential pair: ftdiusb_n, ftdiusb_p
net class mmc: (no net found under the mark)
net class mmc_con: (no net found under the mark)
net class Power: vdd_sd

### Notes on the sheet
- To boot from SD CARD use MCI1A
- Title:
- Author:
- License:
- BSD
- Rev:
- Size:
- A3
- File:
- Date:
- Time:
- Sheet
- of
- (in symbol micro_sd_holde) SD Card

### Library data of the parts
C16 = Cap Pol1: Ceramic X5R 25V; Value: 10uF; Published: 8-Jun-2000; Revision: July-2002: Re-released for DXP Platform.; Publisher: Altium Limited
C17 = Cap: Ceramic X7R 50V; Published: 8-Jun-2000; Revision: July-2002: Re-released for DXP Platform.; Publisher: Altium Limited; Value: 10nF
C18-C23 = Cap: Ceramic X7R 50V; Value: 10nF; Published: 8-Jun-2000; Revision: July-2002: Re-released for DXP Platform.; Publisher: Altium Limited
C24 = Cap Pol1: Ceramic X5R 25V; Published: 8-Jun-2000; Revision: July-2002: Re-released for DXP Platform.; Publisher: Altium Limited; Value: 10uF
C25 = Cap: Ceramic X7R 50V; Value: 100pF; Published: 8-Jun-2000; LatestRevisionDate: 17-Jul-2002; LatestRevisionNote: Re-released for DXP Platform.; PackageReference: RAD-0.3; Publisher: Altium Limited; PackageDescription: Radial Cap, Thru-Hole; 2 Leads; 0.3 in Pin Spacing
D7 = Diode: as D6 on sheet supply
J9 = USB_Con_Type_B_mini_SMT: Mini USB SMT Type B 5 Contacts (WE 65100516121); Manufacturer: Würth Elektronik eiSos GmbH; ComponentLink1 Description: Manufacturer; ComponentLink2 Description: Datasheet; NoPins: 5; ComponentLink1URL: http://www.we-online.de; ComponentLink2URL: http://katalog.we-online.de/em/datasheet/65100516121.pdf; Created by: Karrer Zheng; Created Date: 10/10/2014; partNo: 65100516121
J10 = Header 2X2: Header, 2-Pin, Dual row; LatestRevisionDate: 17-Jul-2002; LatestRevisionNote: Re-released for DXP Platform.; Publisher: Altium Limited
J11 = micro_sd_holde: WR-CRD Micro SD_Push and Push (693071010811); Manufacturer: Würth Elektronik eiSos GmbH; ComponentLink1 Description: Manufacturer; ComponentLink2 Description: Datasheet; NoPins: 8; ComponentLink1URL: http://www.we-online.de; ComponentLink2URL: http://katalog.we-online.de/em/datasheet/693071010811.pdf; Created by: Karrer Zheng; Created Date: 10/10/2014; partNo: 693071010811
L6 L7 L18 L19 = Inductor: WE 742792022
L14 = BEAD_ FERRITE: Ferrite Beat (WE 7427927218)
P?#2 = Header 2: Header, 2-Pin; LatestRevisionDate: 17-Jul-2002; LatestRevisionNote: Re-released for DXP Platform.; Publisher: Altium Limited
Q1 = MOSFET-P 3pin
R33 R35 R37-R49 = Res1: Resistor; Value: 1K; Published: 8-Jun-2000; Revision: July-2002: Re-released for DXP Platform.; Publisher: Altium Limited
R36 = Res1: Resistor; Published: 8-Jun-2000; Revision: July-2002: Re-released for DXP Platform.; Publisher: Altium Limited; Value: 1K
SW1 = tactile_switch: Tactile switch
U4 = FT232RQ: Serial TTL 232 <-> USB (QFN-32)